# Altium project ACU (ra8m1_unshielded).PrjPcb (part 1 of 3)
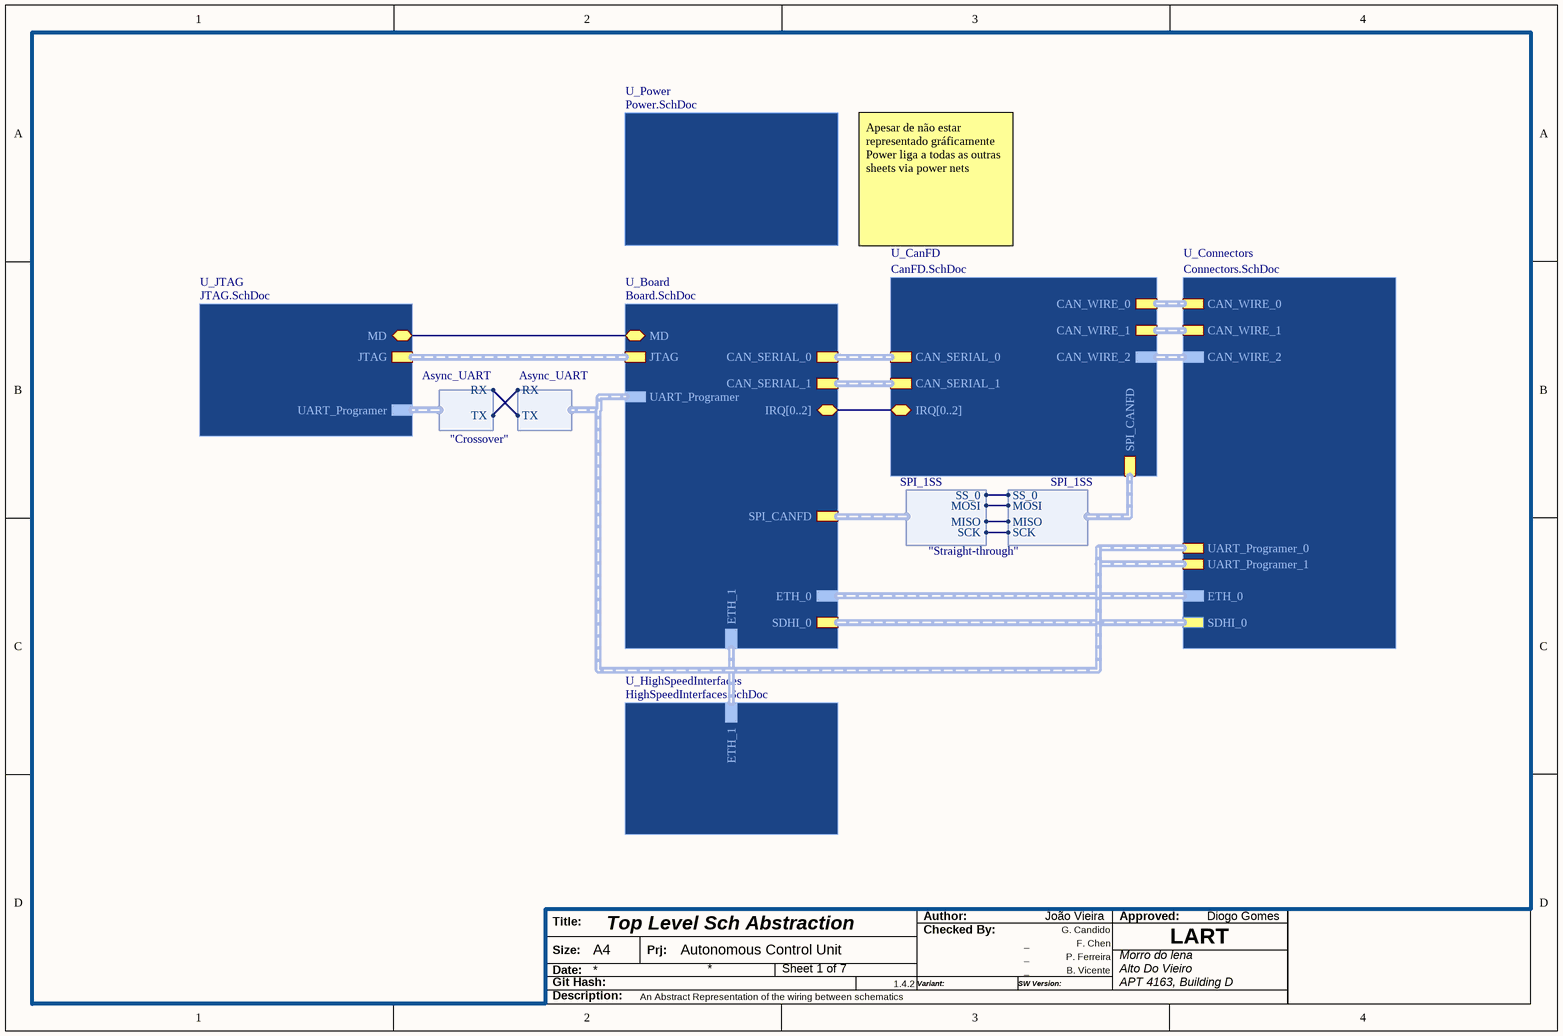
[diagram p0: TopLevelConnections.SchDoc]
12 sheets, 379 parts. Net scope: hierarchical (ports join the sheet entries above them; power ports are global).
Board file: BGA_ACUity.PcbDoc
Sheets:
  TopLevelConnections.SchDoc
    U_Connectors = Connectors.SchDoc
    U_CanFD = CanFD.SchDoc
    U_Board = Board.SchDoc
    U_JTAG = JTAG.SchDoc
    U_HighSpeedInterfaces = HighSpeedInterfaces.SchDoc
    U_Power = Power.SchDoc
  DrivePower.SchDoc
    U_Mosfets0 = Mosfets.SchDoc
    U_Mosfets1 = Mosfets.SchDoc
    U_Mosfets2 = Mosfets.SchDoc
    U_Mosfets3 = Mosfets.SchDoc
    U_Mosfets4 = Mosfets.SchDoc
    U_Mosfets5 = Mosfets.SchDoc
  Watchdog.SchDoc
  ADC-Filter.SchDoc
  TransceiversCanFD.SchDoc

## Sheet TopLevelConnections.SchDoc: Top Level Sch Abstraction
size A4; ApprovedBy: Diogo Gomes; CheckedBy: Bruno, Candido, Pedro; Author: João Vieira; CompanyName: LART; DrawnBy: João Vieira; Organization: LART; Address1: Morro do lena; Address2: Alto Do Vieiro; Address3: APT 4163, Building D; Revision: v1.4.2; SheetNumber: 1; SheetTotal: 7; ProjectTitle: Autonomous Control Unit; CheckedBy1: G. Candido; CheckedBy2: F. Chen; CheckedBy3: P. Ferreira; CheckedBy4: B. Vicente; CheckedBy5: _; CheckedBy6: _; CheckedBy7: _; CHK_APP_DATE: --/--/--; DSN_APP_DATE: --/--/--; ENG_APP_DATE: --/--/--; Summary: An Abstract Representation of the wiring between schematics; version_tag: 1.4.2; ImagePath: C:\Users\micron\Desktop

### Sub-sheets
U_Board = Board.SchDoc: JTAG (harness JTAG), CAN_SERIAL_0 (harness CAN_SERIAL), CAN_SERIAL_1 (harness CAN_SERIAL), ETH_0 (harness ETH_TX), ETH_1 (harness ETH_TX), UART_Programer (harness Async_UART), SDHI_0 (harness SDHI), SPI_CANFD (harness SPI_1SS), IRQ[0..2] (bidir), MD (bidir)
U_CanFD = CanFD.SchDoc: CAN_SERIAL_0 (harness CAN_SERIAL), CAN_SERIAL_1 (harness CAN_SERIAL), SPI_CANFD (harness SPI_1SS), IRQ[0..2] (bidir), CAN_WIRE_1 (harness CAN_WIRE), CAN_WIRE_0 (harness CAN_WIRE), CAN_WIRE_2 (harness CAN_WIRE)
U_Connectors = Connectors.SchDoc: ETH_0 (harness ETH_TX), SDHI_0 (harness SDHI), CAN_WIRE_0 (harness CAN_WIRE), CAN_WIRE_1 (harness CAN_WIRE), CAN_WIRE_2 (harness CAN_WIRE), UART_Programer_0 (harness Async_UART), UART_Programer_1 (harness Async_UART)
U_HighSpeedInterfaces = HighSpeedInterfaces.SchDoc: ETH_1 (harness ETH_TX)
U_JTAG = JTAG.SchDoc: JTAG (harness JTAG), UART_Programer (harness Async_UART), MD (bidir)
U_Power = Power.SchDoc: no entries

### Harnesses
Async_UART: RX, TX
SPI_1SS: MOSI, MISO, SCK, SS_0

### Nets
CANFD_MISO: sheet U_Board/SPI_CANFD.MISO, sheet U_CanFD/SPI_CANFD.MISO
CANFD_MOSI: sheet U_Board/SPI_CANFD.MOSI, sheet U_CanFD/SPI_CANFD.MOSI
CANFD_SCK: sheet U_Board/SPI_CANFD.SCK, sheet U_CanFD/SPI_CANFD.SCK
CANFD_SS: sheet U_Board/SPI_CANFD.SS_0, sheet U_CanFD/SPI_CANFD.SS_0
NetIC1#2_E9: sheet U_Board/MD, sheet U_JTAG/MD
NetJ23_RX_0: sheet U_Connectors/UART_Programer_0.RX, sheet U_JTAG/UART_Programer.TX
NetJ23_TX_0: sheet U_Connectors/UART_Programer_0.TX, sheet U_JTAG/UART_Programer.RX

### Buses and harness runs
bus sheet U_Board/IRQ[0..2] = sheet U_CanFD/IRQ[0..2]
harness sheet U_Board/CAN_SERIAL_0 = sheet U_CanFD/CAN_SERIAL_0
harness sheet U_Board/CAN_SERIAL_1 = sheet U_CanFD/CAN_SERIAL_1
harness sheet U_Board/ETH_0 = sheet U_Connectors/ETH_0
harness sheet U_Board/ETH_1 = sheet U_HighSpeedInterfaces/ETH_1
harness sheet U_Board/JTAG = sheet U_JTAG/JTAG
harness sheet U_Board/SDHI_0 = sheet U_Connectors/SDHI_0
harness sheet U_Board/UART_Programer = sheet U_Connectors/UART_Programer_0 = sheet U_Connectors/UART_Programer_1
harness sheet U_CanFD/CAN_WIRE_0 = sheet U_Connectors/CAN_WIRE_0
harness sheet U_CanFD/CAN_WIRE_1 = sheet U_Connectors/CAN_WIRE_1
harness sheet U_CanFD/CAN_WIRE_2 = sheet U_Connectors/CAN_WIRE_2

### Notes on the sheet
- Apesar de não estar representado gráficamente
  Power liga a todas as outras sheets via power nets
- "Crossover"
- "Straight-through"
- Title:
- Author:
- Checked By:
- Approved:
- Size:
- Date:
- Git Hash:
- A4
- Prj:
- Variant:
- SW Version:
- Description:

## Sheet Connectors.SchDoc: Connectors
size A4; ApprovedBy: Diogo Gomes; CheckedBy: Bruno, Candido, Pedro; Author: João Vieira; CompanyName: LART; DrawnBy: João Vieira; Organization: LART; Address1: Morro do Lena; Address2: Alto Do Vieiro; Address3: APT 4163, Building D; Revision: v1.4.2; SheetNumber: 3; SheetTotal: 7; ProjectTitle: Autonomous Control Unit; CheckedBy1: G. Candido; CheckedBy2: F. Chen; CheckedBy3: P. Ferreira; CheckedBy4: B. Vicente; CheckedBy5: _; CheckedBy6: _; CheckedBy7: _; version_tag: v1.4.2; Summary: Generic connections IO hardware; ImagePath: C:\Users\micron\Desktop
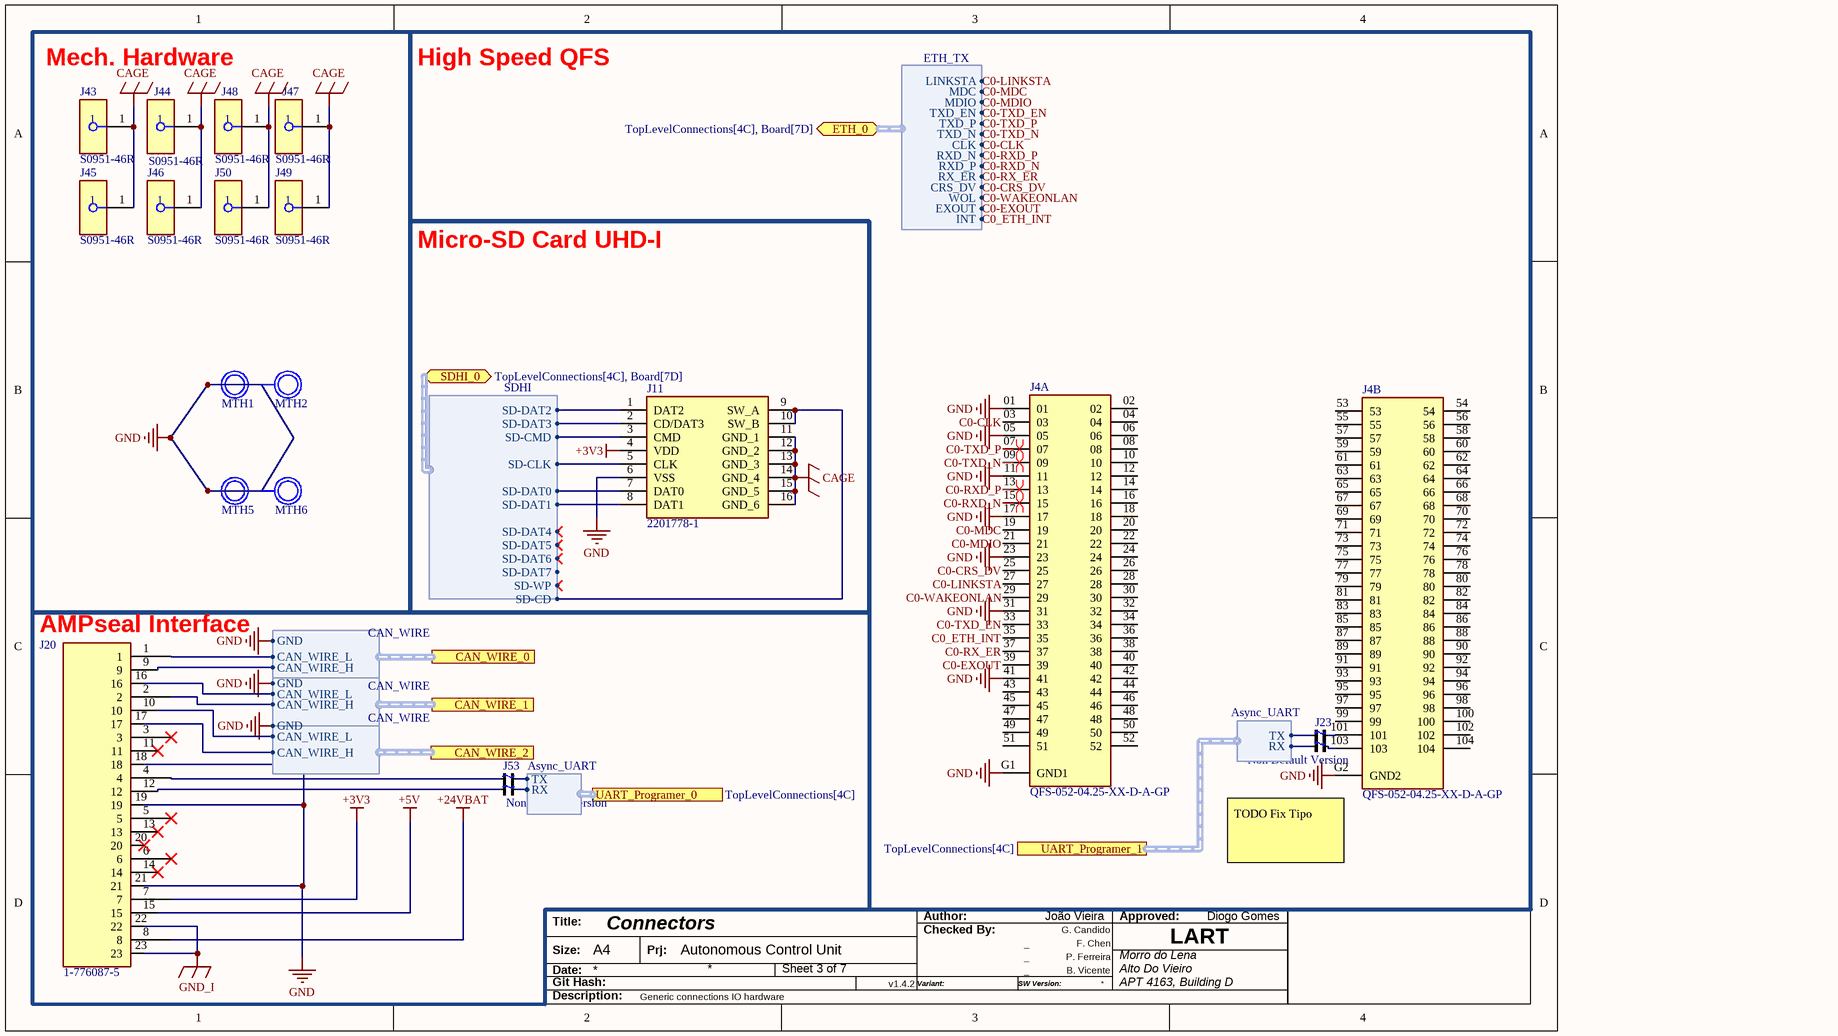
[diagram p1: Connectors.SchDoc]

### Parts
(Parts that share a designator on the sheet are numbered #1, #2 ... from top to bottom, then left to right.)
J4#1  QFS-052-04.25-XX-D-A-GP  [SAMTEC_QFS-052-04.25-XX-D-A-GP]  (parts A,B of 2)
J11#1  2201778-1  [22017781]
J20  1-776087-5  [TE_1-776087-5]
J23  Non Default Version  [PokaYoke Blank]  (no BOM)
J43#1  S0951-46R  [FP-S0951-46R-MFG]
J44#1  S0951-46R  [FP-S0951-46R-MFG]
J45#1  S0951-46R  [FP-S0951-46R-MFG]
J46#1  S0951-46R  [FP-S0951-46R-MFG]
J47#1  S0951-46R  [FP-S0951-46R-MFG]
J48#1  S0951-46R  [FP-S0951-46R-MFG]
J49#1  S0951-46R  [FP-S0951-46R-MFG]
J50  S0951-46R  [FP-S0951-46R-MFG]
J53  Non Default Version  [PokaYoke Blank]  (no BOM)
MTH1  Mounting_Hole_3.5mm  [Mounting_Hole_3.5mm]  (value not drawn)
MTH2  Mounting_Hole_3.5mm  [Mounting_Hole_3.5mm]  (value not drawn)
MTH5  Mounting_Hole_3.5mm  [Mounting_Hole_3.5mm]  (value not drawn)
MTH6  Mounting_Hole_3.5mm  [Mounting_Hole_3.5mm]  (value not drawn)

### Blocks framed on the sheet
Mech. Hardware: J43#1 J44#1 J45#1 J46#1 J47#1 J48#1 J49#1 J50 MTH1 MTH2 MTH5 MTH6
High Speed QFS: J4#1 J23
Micro-SD Card UHD-I: J11#1

### Ports
CAN_WIRE_0 (harness CAN_WIRE, see TopLevelConnections[4B], CanFD[3A]), CAN_WIRE_1 (harness CAN_WIRE, see TopLevelConnections[4B], CanFD[3B]), CAN_WIRE_2 (harness CAN_WIRE, see TopLevelConnections[4B], CanFD[3B]), ETH_0 (bidir, harness ETH_TX, see TopLevelConnections[4C], Board[7D]), SDHI_0 (bidir, harness SDHI, see TopLevelConnections[4C], Board[7D]), UART_Programer_0 (harness Async_UART, see TopLevelConnections[4C]), UART_Programer_1 (harness Async_UART, see TopLevelConnections[4C])

### Harnesses
ETH_TX: MDC, MDIO, TXD_EN, TXD_P, TXD_N, CLK, RXD_N, RXD_P, RX_ER, LINKSTA, CRS_DV, WOL, EXOUT, INT
SDHI: SD-CD, SD-CLK, SD-CMD, SD-DAT0, SD-DAT1, SD-DAT2, SD-DAT3, SD-DAT5, SD-DAT6, SD-WP, SD-DAT4, SD-DAT7
CAN_WIRE: GND, CAN_WIRE_H, CAN_WIRE_L
Async_UART: RX, TX

### Nets
+3V3: J11#1.4(VDD) J20.7
+5V: J20.15
+24VBAT: J20.8
CAGE: J11#1.11(GND_1) J11#1.12(GND_2) J11#1.13(GND_3) J11#1.14(GND_4) J11#1.15(GND_5) J11#1.16(GND_6) J43#1.1 J44#1.1 J45#1.1 J46#1.1 J47#1.1 J48#1.1 J49#1.1 J50.1
GND: J4#1.01 J4#1.05 J4#1.11 J4#1.17 J4#1.23 J4#1.31 J4#1.41 J4#1.G1(GND1) J4#1.G2(GND2) J11#1.6(VSS) J20.18 J20.19 J20.21 MTH1.1 MTH2.1 MTH5.1 MTH6.1 ; port CAN_WIRE_1.GND, port CAN_WIRE_0.GND, port CAN_WIRE_2.GND
GND_I: J20.22 J20.23
C0-CLK: J4#1.03 ; port ETH_0.CLK
C0-CRS_DV: J4#1.25 ; port ETH_0.CRS_DV
C0-EXOUT: J4#1.39 ; port ETH_0.EXOUT
C0-LINKSTA: J4#1.27 ; port ETH_0.LINKSTA
C0-MDC: J4#1.19 ; port ETH_0.MDC
C0-MDIO: J4#1.21 ; port ETH_0.MDIO
C0-RX_ER: J4#1.37 ; port ETH_0.RX_ER
C0-RXD_N: J4#1.15 ; port ETH_0.RXD_P
C0-RXD_P: J4#1.13 ; port ETH_0.RXD_N
C0-TXD_EN: J4#1.33 ; port ETH_0.TXD_EN
C0-TXD_N: J4#1.09 ; port ETH_0.TXD_N
C0-TXD_P: J4#1.07 ; port ETH_0.TXD_P
C0-WAKEONLAN: J4#1.29 ; port ETH_0.WOL
C0_ETH_INT: J4#1.35 ; port ETH_0.INT
SD_CD: J11#1.9(SW_A) J11#1.10(SW_B) ; port SDHI_0.SD-CD
SD_CLK: J11#1.5(CLK) ; port SDHI_0.SD-CLK
SD_CMD: J11#1.3(CMD) ; port SDHI_0.SD-CMD
SD_DATA0: J11#1.7(DAT0) ; port SDHI_0.SD-DAT0
SD_DATA1: J11#1.8(DAT1) ; port SDHI_0.SD-DAT1
SD_DATA2: J11#1.1(DAT2) ; port SDHI_0.SD-DAT2
SD_DATA3: J11#1.2(CD/DAT3) ; port SDHI_0.SD-DAT3
NetIC1#1_6: J20.1 ; port CAN_WIRE_0.CAN_WIRE_L
NetIC1#1_7: J20.9 ; port CAN_WIRE_0.CAN_WIRE_H
NetIC2#1_6: J20.16 ; port CAN_WIRE_1.CAN_WIRE_L
NetIC2#1_7: J20.2 ; port CAN_WIRE_1.CAN_WIRE_H
NetIC3_6: J20.10 ; port CAN_WIRE_2.CAN_WIRE_L
NetIC3_7: J20.17 ; port CAN_WIRE_2.CAN_WIRE_H
NetJ4#1_101: J4#1.101 J23.TX_1
NetJ4#1_103: J4#1.103 J23.RX_1
NetJ20_4: J20.4 J53.TX_0
NetJ20_12: J20.12 J53.RX_0
NetJ23_RX_0: J23.RX_0 J53.RX_1 ; port UART_Programer_0.RX
NetJ23_TX_0: J23.TX_0 J53.TX_1 ; port UART_Programer_0.TX

Not connected (* = marked no-connect by the designer): J4#1 02 04 06 08 10 12 14 16 18 20 22 24 26 28 30 32 34 36 38 40 42 43 44 45 46 47 48 49 50 51 52 53 54 55 56 57 58 59 60 61 62 63 64 65 66 67 68 69 70 71 72 73 74 75 76 77 78 79 80 81 82 83 84 85 86 87 88 89 90 91 92 93 94 95 96 97 98 99 100 102 104; J20 3* 5* 6* 11* 13* 14* 20*

### Layout directives
differential pair: C0-RXD_N, C0-RXD_P, C0-TXD_N, C0-TXD_P

### Notes on the sheet
- (near J20) AMPseal Interface
- (near J4#1) TODO Fix Tipo
- Title:
- Author:
- Checked By:
- Approved:
- Size:
- Date:
- Git Hash:
- A4
- Prj:
- Variant:
- SW Version:
- Description:

### Library data of the parts
J4#1 = QFS-052-04.25-XX-D-A-GP: CONN RCPT 104POS SMD GOLD; Availability: Unavailable; Package: None; MP: QFS-052-04.25-XX-D-A-GP; Value: *; Price: None
J11#1 = 2201778-1: Connector; Manufacturer_Name: TE Connectivity; Datasheet Link: https://www.te.com/commerce/DocumentDelivery/DDEController?Action=showdoc&DocId=Customer+Drawing%7F2201778%7FB%7Fpdf%7FJapanese%7FJPN_CD_2201778_B.pdf%7F2201778-1; Height: 1.95mm; Manufacturer_Part_Number: 2201778-1; Mouser Part Number: 571-2201778-1; Mouser Price/Stock: https://www.mouser.co.uk/ProductDetail/TE-Connectivity/2201778-1?qs=%2F6W%2F9%2FHWvcBMWWw9w8oBng%3D%3D; Arrow Part Number: 2201778-1; Arrow Price/Stock: https://www.arrow.com/en/products/2201778-1/te-connectivity?region=nac
J20 = 1-776087-5: CONN HDR 23POS R/A W/GASKET AU; MF: {'manufacturer': 'TE Connectivity'}; Package: None; Value: *; Availability: Unavailable; MP: 1-776087-5; Price: None
J23 J53 = Poka-Yoke 2x2
J43#1 J44#1 J45#1 J46#1 J47#1 J48#1 J49#1 J50 = CMP-002-00075-1: Assembly Item

## Sheet CanFD.SchDoc: CanFD Components
size A4; ApprovedBy: Diogo Gomes; CheckedBy: Bruno, Candido, Pedro; Author: João Vieira; CompanyName: LART; DrawnBy: João Vieira; Organization: LART; Address1: Morro do lena; Address2: Alto Do Vieiro; Address3: APT 4163, Building D; Revision: v1.4.2; SheetNumber: 5; SheetTotal: 7; ProjectTitle: Autonomous Control Unit; CheckedBy1: G. Candido; CheckedBy2: F. Chen; CheckedBy3: P. Ferreira; CheckedBy4: B. Vicente; CheckedBy5: _; CheckedBy6: _; CheckedBy7: _; CHK_APP_DATE: --/--/--; DSN_APP_DATE: --/--/--; ENG_APP_DATE: --/--/--; Summary: Various CAN FD components; version_tag: 1.4.2; ImagePath: C:\Users\micron\Desktop
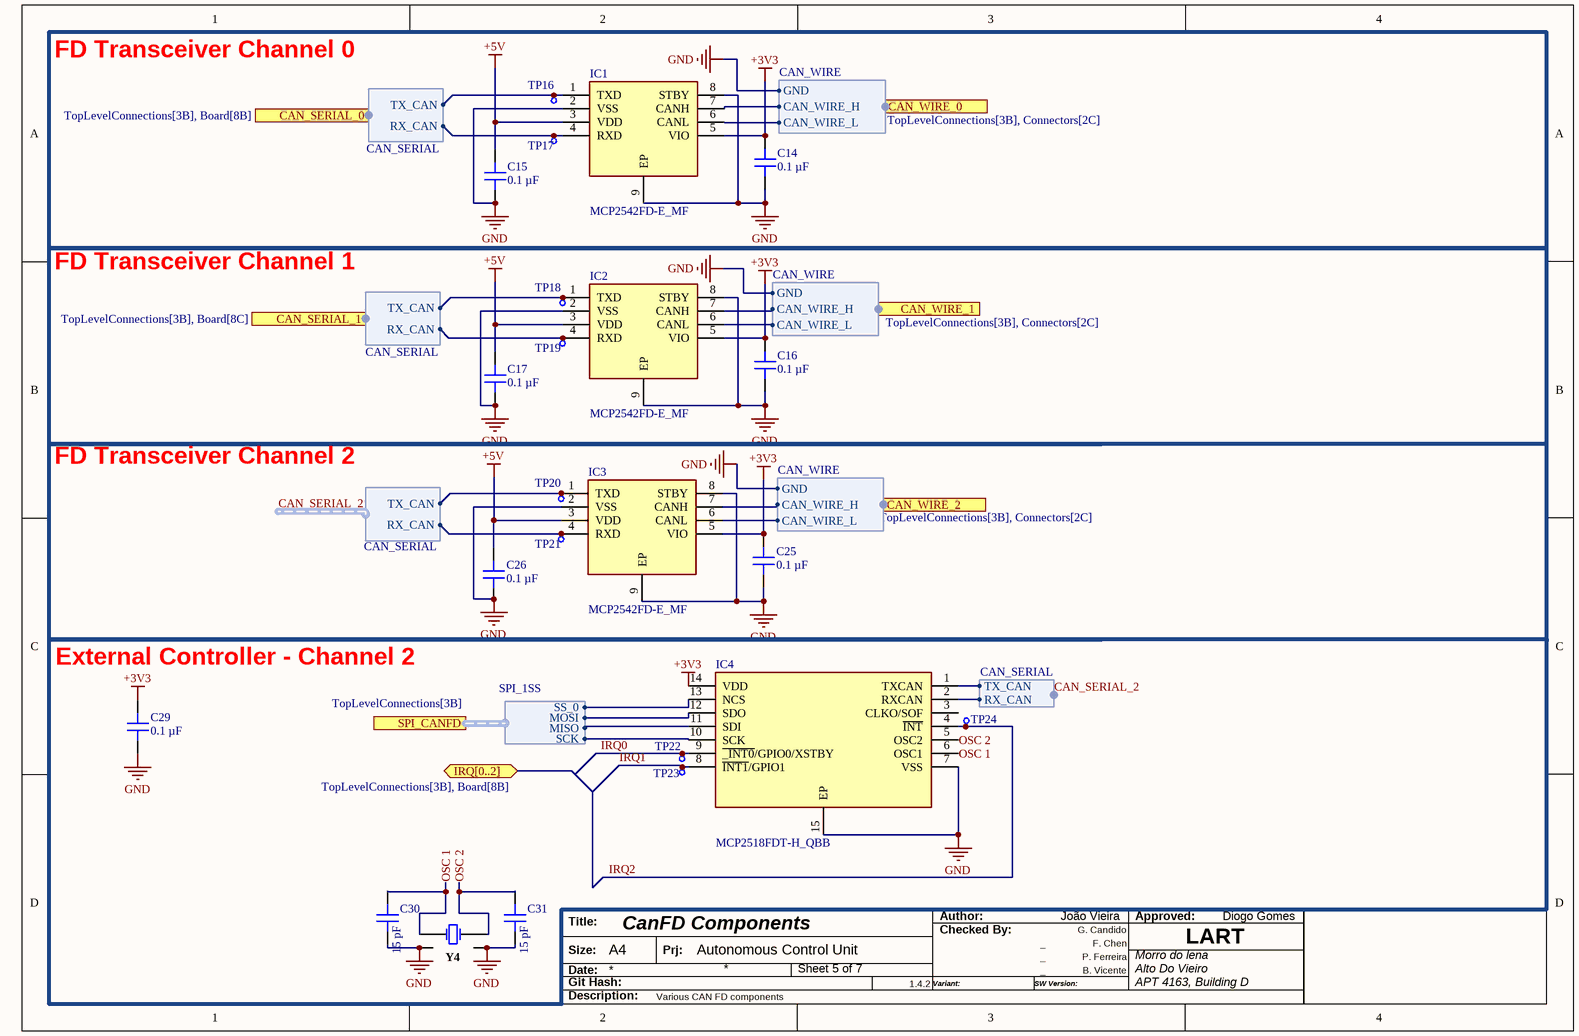
[diagram p2: CanFD.SchDoc]

### Parts
(Parts that share a designator on the sheet are numbered #1, #2 ... from top to bottom, then left to right.)
C14  value 0.1 µF  [CAP 0805_2012]  (hidden comment: 0.1uF)
C15#1  value 0.1 µF  [CAP 0805_2012]  (hidden comment: 0.1uF)
C16#1  value 0.1 µF  [CAP 0805_2012]  (hidden comment: 0.1uF)
C17#1  value 0.1 µF  [CAP 0805_2012]  (hidden comment: 0.1uF)
C25#1  value 0.1 µF  [CAP 0805_2012]  (hidden comment: 0.1uF)
C26#1  value 0.1 µF  [CAP 0805_2012]  (hidden comment: 0.1uF)
C29#1  0.1 µF  [CAP 0805_2012]
C30  15 pF  [CAP 0805_2012]
C31#1  15 pF  [CAP 0805_2012]
IC1#1  MCP2542FD-E_MF  [SON65P300X300X100-9N-D]
IC2#1  MCP2542FD-E_MF  [SON65P300X300X100-9N-D]
IC3  MCP2542FD-E_MF  [SON65P300X300X100-9N-D]
IC4  MCP2518FDT-H_QBB  [SON65P300X450X90-15N-D]
TP16#1  TestPad  [Test Pad Small]  (value not drawn)
TP17#1  TestPad  [Test Pad Small]  (value not drawn)
TP18  TestPad  [Test Pad Small]  (value not drawn)
TP19  TestPad  [Test Pad Small]  (value not drawn)
TP20#1  TestPad  [Test Pad Small]  (value not drawn)
TP21  TestPad  [Test Pad Small]  (value not drawn)
TP22  TestPad  [Test Pad Small]  (value not drawn)
TP23#1  TestPad  [Test Pad Small]  (value not drawn)
TP24#1  TestPad  [Test Pad Small]  (value not drawn)
Y4#1  ABM8-20.000MHZ-10-1-U-T  [FP-ABM8-MFG]  (value not drawn)

### Blocks framed on the sheet
FD Transceiver Channel 0: C14 C15#1 IC1#1 TP16#1 TP17#1
External Controller - Channel 2: C29#1 C30 C31#1 IC4 TP22 TP23#1 TP24#1 Y4#1

### Ports
CAN_SERIAL_0 (harness CAN_SERIAL, see TopLevelConnections[3B], Board[8B]), CAN_SERIAL_1 (harness CAN_SERIAL, see TopLevelConnections[3B], Board[8C]), CAN_WIRE_0 (harness CAN_WIRE, see TopLevelConnections[3B], Connectors[2C]), CAN_WIRE_1 (harness CAN_WIRE, see TopLevelConnections[3B], Connectors[2C]), CAN_WIRE_2 (harness CAN_WIRE, see TopLevelConnections[3B], Connectors[2C]), IRQ[0..2] (bidir, see TopLevelConnections[3B], Board[8B]), SPI_CANFD (harness SPI_1SS, see TopLevelConnections[3B])

### Harnesses
CAN_SERIAL: RX_CAN, TX_CAN
CAN_WIRE: GND, CAN_WIRE_H, CAN_WIRE_L
SPI_1SS: MOSI, MISO, SS_0, SCK

### Nets
+3V3: C14.2 C16#1.2 C25#1.2 C29#1.2 IC1#1.5(VIO) IC2#1.5(VIO) IC3.5(VIO) IC4.14(VDD)
+5V: C15#1.2 C17#1.2 C26#1.2 IC1#1.3(VDD) IC2#1.3(VDD) IC3.3(VDD)
GND: C14.1 C15#1.1 C16#1.1 C17#1.1 C25#1.1 C26#1.1 C29#1.1 C30.1 C31#1.1 IC1#1.2(VSS) IC1#1.8(STBY) IC1#1.9(EP) IC2#1.2(VSS) IC2#1.8(STBY) IC2#1.9(EP) IC3.2(VSS) IC3.8(STBY) IC3.9(EP) IC4.7(VSS) IC4.15(EP) Y4#1.3 Y4#1.4 ; port CAN_WIRE_0.GND, port CAN_WIRE_1.GND, port CAN_WIRE_2.GND
CAN_RX_0: IC1#1.4(RXD) TP17#1.P2 ; port CAN_SERIAL_0.RX_CAN
CAN_RX_1: IC2#1.4(RXD) TP19.P2 ; port CAN_SERIAL_1.RX_CAN
CAN_SERIAL_2.RX_CAN: IC3.4(RXD) IC4.2(RXCAN) TP21.P2 ; harness CAN_SERIAL.RX_CAN
CAN_SERIAL_2.TX_CAN: IC3.1(TXD) IC4.1(TXCAN) TP20#1.P2 ; harness CAN_SERIAL.TX_CAN
CAN_TX_0: IC1#1.1(TXD) TP16#1.P2 ; port CAN_SERIAL_0.TX_CAN
CAN_TX_1: IC2#1.1(TXD) TP18.P2 ; port CAN_SERIAL_1.TX_CAN
CANFD_MISO: IC4.11(SDI) ; port SPI_CANFD.MISO
CANFD_MOSI: IC4.12(SDO) ; port SPI_CANFD.MOSI
CANFD_SCK: IC4.10(SCK) ; port SPI_CANFD.SCK
CANFD_SS: IC4.13(NCS) ; port SPI_CANFD.SS_0
IRQ0: IC4.9(~{_INT0}/GPIO0/XSTBY) TP22.P2  [project net IRQ0_5]
IRQ1: IC4.8(~{INT1}/GPIO1) TP23#1.P2  [project net IRQ1_5]
IRQ2: IC4.4(~{INT}) TP24#1.P2  [project net IRQ2_5]
OSC 1: C30.2 IC4.6(OSC1) Y4#1.1  [project net OSC 1_5]
OSC 2: C31#1.2 IC4.5(OSC2) Y4#1.2  [project net OSC 2_5]
NetIC1#1_6: IC1#1.6(CANL) ; port CAN_WIRE_0.CAN_WIRE_L
NetIC1#1_7: IC1#1.7(CANH) ; port CAN_WIRE_0.CAN_WIRE_H
NetIC2#1_6: IC2#1.6(CANL) ; port CAN_WIRE_1.CAN_WIRE_L
NetIC2#1_7: IC2#1.7(CANH) ; port CAN_WIRE_1.CAN_WIRE_H
NetIC3_6: IC3.6(CANL) ; port CAN_WIRE_2.CAN_WIRE_L
NetIC3_7: IC3.7(CANH) ; port CAN_WIRE_2.CAN_WIRE_H

Not connected (* = marked no-connect by the designer): IC4 3(CLKO/SOF)

### Notes on the sheet
- FD Transceiver Channel 1
- FD Transceiver Channel 2
- Title:
- Author:
- Checked By:
- Approved:
- Size:
- Date:
- Git Hash:
- A4
- Prj:
- Variant:
- SW Version:
- Description:

### Library data of the parts
C14 C15#1 C16#1 C17#1 C25#1 C26#1 = CC0805MRX7R9BB104: CAP CER 0.1UF 50V X7R 0805; manufacturer: Yageo; Tolerance: ±20%; Part Number: CC0805MRX7R9BB104; Applications: General Purpose; Capacitance: 0.1 µF; componentlink1description: Datasheet; componentlink1url: https://www.yageo.com/upload/media/product/productsearch/datasheet/mlcc/UPY-GPHC_X7R_6.3V-to-50V_18.pdf; componentlink2description: DigiKey Link; componentlink2url: https://www.digikey.com/en/products/detail/yageo/CC0805MRX7R9BB104/5884281; Device Package: 0805 (2012 Metric); lastupdated: 09/02/2024 20:16:09; Lifecycle Status: Active; Minimum Order: 1; Mounting Type: Surface Mount, MLCC; Operating Temperature: -55°C ~ 125°C; Package / Case: 0805 (2012 Metric); packaging: TapeAndReel; partid: 2475; Part Status: Active; price: 0.01; series: CC; Size / Dimension: 0.079" L x 0.049" W (2.00mm x 1.25mm); Supplier 1: DigiKey; Supplier Part Number 1: 311-4351-1-ND; Temperature Coefficient: X7R; Thickness (Max): 0.037" (0.95mm); Voltage - Rated: 50V
C29#1 = VJ0805Y104MXAMR: CAP CER 0.1UF 50V X7R 0805; manufacturer: Vishay Vitramon; Tolerance: ±20%; Part Number: VJ0805Y104MXAMR; Value: 0.1 µF; Applications: General Purpose; Capacitance: 0.1 µF; componentlink1description: Datasheet; componentlink1url: http://www.vishay.com/docs/45199/vjcommercialseries.pdf; componentlink2description: DigiKey Link; componentlink2url: https://www.digikey.com/en/products/detail/vishay-vitramon/VJ0805Y104MXAMR/8311084; Device Package: 0805 (2012 Metric); lastupdated: 04/02/2024 20:15:56; Lifecycle Status: Active; Minimum Order: 1; Mounting Type: Surface Mount, MLCC; Operating Temperature: -55°C ~ 150°C; Package / Case: 0805 (2012 Metric); packaging: TapeAndReel; partid: 14439; Part Status: Active; price: 0.09; series: VJ; Size / Dimension: 0.079" L x 0.049" W (2.00mm x 1.25mm); Supplier 1: DigiKey; Supplier Part Number 1: 720-1755-1-ND; Temperature Coefficient: X7R; Thickness (Max): 0.057" (1.45mm); Voltage - Rated: 50V
C30 C31#1 = VJ0805D150JXPQJHT: CAP CER 15PF 250V C0G/NP0 0805; manufacturer: Vishay Vitramon; Temperature Coefficient: C0G, NP0; Tolerance: ±5%; Part Number: VJ0805D150JXPQJHT; Value: 15 pF; Applications: RF, Microwave, High Frequency; Capacitance: 15 pF; componentlink1description: Datasheet; componentlink1url: https://www.vishay.com/docs/45239/vjhifreqht.pdf; componentlink2description: DigiKey Link; componentlink2url: https://www.digikey.com/en/products/detail/vishay-vitramon/VJ0805D150JXPQJHT/14292748; Device Package: 0805 (2012 Metric); Features: High Temperature; lastupdated: 04/02/2024 20:15:19; Lifecycle Status: Active; Minimum Order: 1; Mounting Type: Surface Mount, MLCC; Operating Temperature: -55°C ~ 200°C; Package / Case: 0805 (2012 Metric); packaging: TapeAndReel; partid: 31685; Part Status: Active; price: 0.11; series: VJ HIFREQ HT; Size / Dimension: 0.079" L x 0.049" W (2.00mm x 1.25mm); Supplier 1: DigiKey; Supplier Part Number 1: 720-VJ0805D150JXPQJHTCT-ND; Thickness (Max): 0.057" (1.45mm); Voltage - Rated: 250V
IC1#1 IC2#1 IC3 = MCP2542FD-E_MF: Integrated Circuit; Manufacturer_Name: Microchip; Manufacturer_Part_Number: MCP2542FD-E/MF; Datasheet Link: http://ww1.microchip.com/downloads/en/devicedoc/20005514a.pdf; Height: 1mm; Mouser Part Number: 579-MCP2542FD-E/MF; Mouser Price/Stock: https://www.mouser.co.uk/ProductDetail/Microchip-Technology-Atmel/MCP2542FD-E-MF?qs=l7cgNqFNU1jog4BwTzULBw%3D%3D; Arrow Part Number: MCP2542FD-E/MF; Arrow Price/Stock: https://www.arrow.com/en/products/mcp2542fd-emf/microchip-technology?region=nac
IC4 = MCP2518FDT-H_QBB: Integrated Circuit; Manufacturer_Name: Microchip; Manufacturer_Part_Number: MCP2518FDT-H/QBB; Datasheet Link: https://www.mouser.in/datasheet/2/268/MCP2518FD-Data-Sheet-20006027A-1596921.pdf; Height: 0.9mm; Mouser Part Number: 579-MCP2518FDT-H/QBB; Mouser Price/Stock: https://www.mouser.co.uk/ProductDetail/Microchip-Technology/MCP2518FDT-H-QBB?qs=T3oQrply3y8bDZ20CsIcGQ%3D%3D; Arrow Part Number: MCP2518FDT-H/QBB; Arrow Price/Stock: https://www.arrow.com/en/products/mcp2518fdt-hqbb/microchip-technology?region=nac
Y4#1 = CMP-003-00030-2: Crystal 20MHz ±10ppm (Tol) ±10ppm (Stability) 10pF FUND 50Ohm 4-Pin Ultra Mini-CSMD T/R

## Sheet Board.SchDoc: Main MCU
size A3; ApprovedBy: Diogo Gomes; CheckedBy: Bruno, Candido, Pedro; Author: João Vieira; CompanyName: LART; DrawnBy: João Vieira; Organization: LART; Address1: Morro do lena; Address2: Alto Do Vieiro; Address3: APT 4163, Building D; Revision: v1.4.2; SheetNumber: 4; SheetTotal: 12; ProjectTitle: Autonomous Control Unit; CheckedBy1: G. Candido; CheckedBy2: F. Chen; CheckedBy3: P. Ferreira; CheckedBy4: B. Vicente; CheckedBy5: _; CheckedBy6: _; CheckedBy7: _; CHK_APP_DATE: --/--/--; DSN_APP_DATE: --/--/--; ENG_APP_DATE: --/--/--; Summary: The Main Microcontroller that powers the entire ACU; version_tag: 1.4.2; ImagePath: C:\Users\micron\Desktop
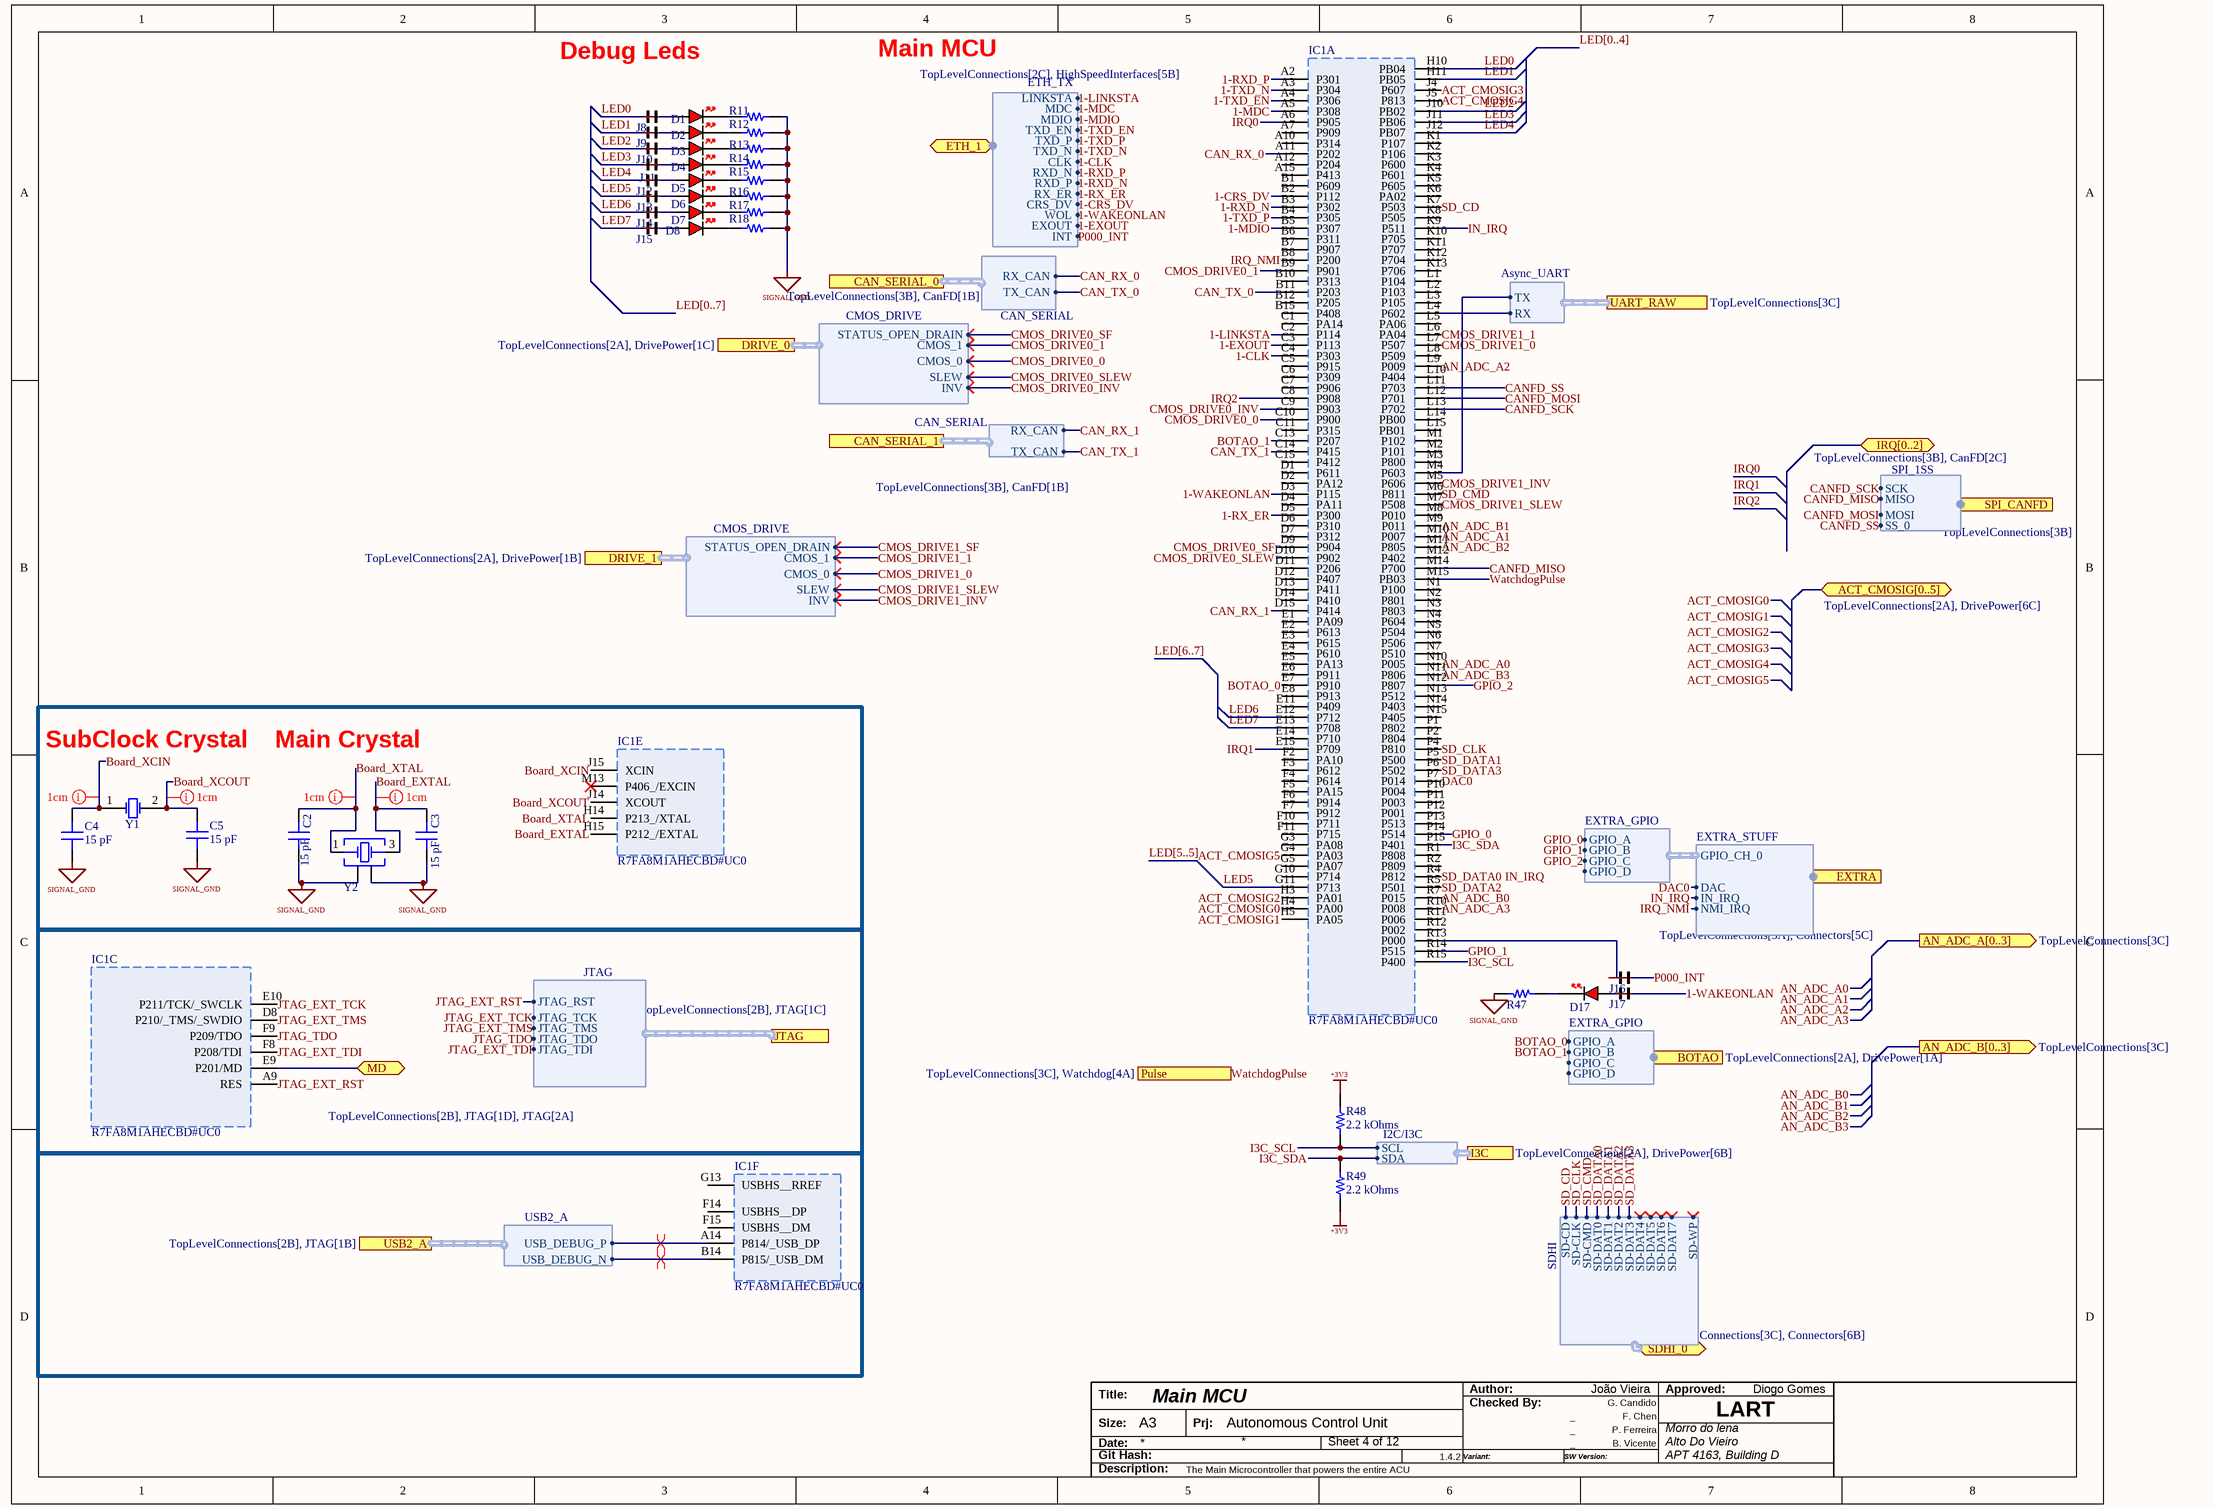
[diagram p3: Board.SchDoc]

### Parts
(Parts that share a designator on the sheet are numbered #1, #2 ... from top to bottom, then left to right.)
C2  value 15 pF  [CAP 0805_2012]  (hidden comment: 15pF)
C3  value 15 pF  [CAP 0805_2012]  (hidden comment: 15pF)
C4  value 15 pF  [CAP 0805_2012]  (hidden comment: 15pF)
C5  value 15 pF  [CAP 0805_2012]  (hidden comment: 15pF)
D1  RED  [LED_0603_RED]  (value not drawn)
D2  RED  [LED_0603_RED]  (value not drawn)
D3  RED  [LED_0603_RED]  (value not drawn)
D4  RED  [LED_0603_RED]  (value not drawn)
D5  RED  [LED_0603_RED]  (value not drawn)
D6  RED  [LED_0603_RED]  (value not drawn)
D7  RED  [LED_0603_RED]  (value not drawn)
D8  RED  [LED_0603_RED]  (value not drawn)
D17  RED  [LED_0603_RED]  (value not drawn)
IC1#2  R7FA8M1AHECBD#UC0  [RA8M1_BGA]  (parts A,C,E,F of 6)
J8  A solder Bridge  [Solder Bridge 805]  (value not drawn)
J9  A solder Bridge  [Solder Bridge 805]  (value not drawn)
J10  A solder Bridge  [Solder Bridge 805]  (value not drawn)
J11#2  A solder Bridge  [Solder Bridge 805]  (value not drawn)
J12  A solder Bridge  [Solder Bridge 805]  (value not drawn)
J13  A solder Bridge  [Solder Bridge 805]  (value not drawn)
J14  A solder Bridge  [Solder Bridge 805]  (value not drawn)
J15  A solder Bridge  [Solder Bridge 805]  (value not drawn)
J16  A solder Bridge  [Solder Bridge 805]  (value not drawn)
J17  A solder Bridge  [Solder Bridge 805]  (value not drawn)
R11  LEDS  [RES 0805_2012]  (value not drawn)
R12  LEDS  [RES 0805_2012]  (value not drawn)
R13  LEDS  [RES 0805_2012]  (value not drawn)
R14  LEDS  [RES 0805_2012]  (value not drawn)
R15  LEDS  [RES 0805_2012]  (value not drawn)
R16  LEDS  [RES 0805_2012]  (value not drawn)
R17  LEDS  [RES 0805_2012]  (value not drawn)
R18  LEDS  [RES 0805_2012]  (value not drawn)
R47  LEDS  [RES 0805_2012]  (value not drawn)
R48  2.2 kOhms  [RES 0402_1005]
R49  2.2 kOhms  [RES 0402_1005]
Y1  32.768kHz  [WE-XTAL_IQXC-25]  (value not drawn)
Y2  20MHz  [WE-XTAL_CFPX-180]  (value not drawn)

### Ports
ACT_CMOSIG[0..5] (bidir, see TopLevelConnections[2A], DrivePower[6C]), AN_ADC_A[0..3] (out, see TopLevelConnections[3C]), AN_ADC_B[0..3] (out, see TopLevelConnections[3C]), BOTAO (harness EXTRA_GPIO, see TopLevelConnections[2A], DrivePower[1A]), CAN_SERIAL_0 (harness CAN_SERIAL, see TopLevelConnections[3B], CanFD[1B]), CAN_SERIAL_1 (harness CAN_SERIAL, see TopLevelConnections[3B], CanFD[1B]), DRIVE_0 (harness CMOS_DRIVE, see TopLevelConnections[2A], DrivePower[1C]), DRIVE_1 (harness CMOS_DRIVE, see TopLevelConnections[2A], DrivePower[1B]), ETH_1 (bidir, harness ETH_TX, see TopLevelConnections[2C], HighSpeedInterfaces[5B]), EXTRA (harness EXTRA_STUFF, see TopLevelConnections[3A], Connectors[5C]), I3C (harness I2C/I3C, see TopLevelConnections[2A], DrivePower[6B]), IRQ[0..2] (bidir, see TopLevelConnections[3B], CanFD[2C]), JTAG (harness JTAG, see TopLevelConnections[2B], JTAG[1C]), MD (bidir, see TopLevelConnections[2B], JTAG[1D], JTAG[2A]), Pulse (in, see TopLevelConnections[3C], Watchdog[4A]), SDHI_0 (bidir, harness SDHI, see TopLevelConnections[3C], Connectors[6B]), SPI_CANFD (harness SPI_1SS, see TopLevelConnections[3B]), UART_RAW (harness Async_UART, see TopLevelConnections[3C]), USB2_A (harness USB2_A, see TopLevelConnections[2B], JTAG[1B])

### Harnesses
JTAG: JTAG_RST, JTAG_TCK, JTAG_TMS, JTAG_TDO, JTAG_TDI
ETH_TX: MDC, MDIO, TXD_EN, TXD_P, TXD_N, CLK, RXD_N, RXD_P, RX_ER, LINKSTA, CRS_DV, WOL, EXOUT, INT
CAN_SERIAL: RX_CAN, TX_CAN
Async_UART: RX, TX
SDHI: SD-CD, SD-CLK, SD-CMD, SD-DAT0, SD-DAT1, SD-DAT2, SD-DAT3, SD-DAT4, SD-DAT5, SD-DAT6, SD-DAT7, SD-WP
SPI_1SS: MOSI, MISO, SCK, SS_0
USB2_A: USB_DEBUG_N, USB_DEBUG_P
CMOS_DRIVE: CMOS_0, CMOS_1, INV, SLEW, STATUS_OPEN_DRAIN
EXTRA_STUFF: GPIO_CH_0, DAC, IN_IRQ, NMI_IRQ
EXTRA_GPIO: GPIO_A, GPIO_B, GPIO_C, GPIO_D
I2C/I3C: SCL, SDA

### Nets
+3V3: R48.2 R49.1
SIGNAL_GND: C2.1 C3.1 C4.1 C5.1 R11.2 R12.2 R13.2 R14.2 R15.2 R16.2 R17.2 R18.2 R47.2 Y2.2(GND&Lid) Y2.4(GND&Lid)
1-CLK: IC1#2.C4(P303) ; port ETH_1.CLK
1-CRS_DV: IC1#2.B2(P112) ; port ETH_1.CRS_DV
1-EXOUT: IC1#2.C3(P113) ; port ETH_1.EXOUT
1-LINKSTA: IC1#2.C2(P114) ; port ETH_1.LINKSTA
1-MDC: IC1#2.A5(P308) ; port ETH_1.MDC
1-MDIO: IC1#2.B5(P307) ; port ETH_1.MDIO
1-RX_ER: IC1#2.D5(P300) ; port ETH_1.RX_ER
1-RXD_N: IC1#2.B3(P302) ; port ETH_1.RXD_P
1-RXD_P: IC1#2.A2(P301) ; port ETH_1.RXD_N
1-TXD_EN: IC1#2.A4(P306) ; port ETH_1.TXD_EN
1-TXD_N: IC1#2.A3(P304) ; port ETH_1.TXD_N
1-TXD_P: IC1#2.B4(P305) ; port ETH_1.TXD_P
1-WAKEONLAN: IC1#2.D3(P115) J17.P1 ; port ETH_1.WOL
ACT_CMOSIG0: IC1#2.H4(PA00)  [project net ACT_CMOSIG0_4]
ACT_CMOSIG1: IC1#2.H5(PA05)  [project net ACT_CMOSIG1_4]
ACT_CMOSIG2: IC1#2.H3(PA01)  [project net ACT_CMOSIG2_4]
ACT_CMOSIG3: IC1#2.J4(P607)  [project net ACT_CMOSIG3_4]
ACT_CMOSIG4: IC1#2.J5(P813)  [project net ACT_CMOSIG4_4]
ACT_CMOSIG5: IC1#2.G4(PA03)  [project net ACT_CMOSIG5_4]
AN_ADC_A0: IC1#2.N10(P005)  [project net AN_ADC_A0_4]
AN_ADC_A1: IC1#2.M10(P007)  [project net AN_ADC_A1_4]
AN_ADC_A2: IC1#2.L9(P009)  [project net AN_ADC_A2_4]
AN_ADC_A3: IC1#2.R10(P008)  [project net AN_ADC_A3_4]
AN_ADC_B0: IC1#2.R7(P015)  [project net AN_ADC_B0_4]
AN_ADC_B1: IC1#2.M9(P011)  [project net AN_ADC_B1_4]
AN_ADC_B2: IC1#2.M11(P805)  [project net AN_ADC_B2_4]
AN_ADC_B3: IC1#2.N11(P806)  [project net AN_ADC_B3_4]
Board_EXTAL: C3.2 IC1#2.H15(P212_/EXTAL) Y2.3(Crystal)  [project net Board_EXTAL_4]
Board_XCIN: C4.2 IC1#2.J15(XCIN) Y1.1(OSC1)  [project net Board_XCIN_4]
Board_XCOUT: C5.2 IC1#2.J14(XCOUT) Y1.2(OSC2)  [project net Board_XCOUT_4]
Board_XTAL: C2.2 IC1#2.H14(P213_/XTAL) Y2.1(Crystal)  [project net Board_XTAL_4]
BOTAO_0: IC1#2.E7(P910) ; port BOTAO.GPIO_A
BOTAO_1: IC1#2.C13(P207) ; port BOTAO.GPIO_B
CAN_RX_0: IC1#2.A11(P202) ; port CAN_SERIAL_0.RX_CAN
CAN_RX_1: IC1#2.D15(P414) ; port CAN_SERIAL_1.RX_CAN
CAN_TX_0: IC1#2.B11(P203) ; port CAN_SERIAL_0.TX_CAN
CAN_TX_1: IC1#2.C14(P415) ; port CAN_SERIAL_1.TX_CAN
CANFD_MISO: IC1#2.M14(P700) ; port SPI_CANFD.MISO
CANFD_MOSI: IC1#2.L12(P701) ; port SPI_CANFD.MOSI
CANFD_SCK: IC1#2.L13(P702) ; port SPI_CANFD.SCK
CANFD_SS: IC1#2.L11(P703) ; port SPI_CANFD.SS_0
CMOS_DRIVE0_0: IC1#2.C10(P900) ; port DRIVE_0.CMOS_0
CMOS_DRIVE0_1: IC1#2.B9(P901) ; port DRIVE_0.CMOS_1
CMOS_DRIVE0_INV: IC1#2.C9(P903) ; port DRIVE_0.INV
CMOS_DRIVE0_SF: IC1#2.D9(P904) ; port DRIVE_0.STATUS_OPEN_DRAIN
CMOS_DRIVE0_SLEW: IC1#2.D10(P902) ; port DRIVE_0.SLEW
CMOS_DRIVE1_0: IC1#2.L7(P507) ; port DRIVE_1.CMOS_0
CMOS_DRIVE1_1: IC1#2.L6(PA04) ; port DRIVE_1.CMOS_1
CMOS_DRIVE1_INV: IC1#2.M5(P606) ; port DRIVE_1.INV
CMOS_DRIVE1_SF: port DRIVE_1.STATUS_OPEN_DRAIN
CMOS_DRIVE1_SLEW: IC1#2.M7(P508) ; port DRIVE_1.SLEW
DAC0: IC1#2.P7(P014) ; port EXTRA.DAC
GPIO_0: IC1#2.P14(P514) ; harness EXTRA_GPIO.GPIO_A
GPIO_1: IC1#2.R14(P515) ; harness EXTRA_GPIO.GPIO_B
GPIO_2: IC1#2.N12(P807) ; harness EXTRA_GPIO.GPIO_C
I3C_SCL: IC1#2.R15(P400) R48.1 ; port I3C.SCL
I3C_SDA: IC1#2.P15(P401) R49.2 ; port I3C.SDA
IN_IRQ: IC1#2.K9(P511) ; port EXTRA.IN_IRQ
IRQ0: IC1#2.A6(P905)  [project net IRQ0_4]
IRQ1: IC1#2.E15(P709)  [project net IRQ1_4]
IRQ2: IC1#2.C8(P908)  [project net IRQ2_4]
IRQ_NMI: IC1#2.B8(P200) ; port EXTRA.NMI_IRQ
JTAG_EXT_RST: IC1#2.A9(RES) ; port JTAG.JTAG_RST
JTAG_EXT_TCK: IC1#2.E10(P211/TCK/_SWCLK) ; port JTAG.JTAG_TCK
JTAG_EXT_TDI: IC1#2.F8(P208/TDI) ; port JTAG.JTAG_TDI
JTAG_EXT_TMS: IC1#2.D8(P210/_TMS/_SWDIO) ; port JTAG.JTAG_TMS
JTAG_TDO: IC1#2.F9(P209/TDO) ; port JTAG.JTAG_TDO
LED0: IC1#2.H10(PB04) J8.P0  [project net LED0_4]
LED1: IC1#2.H11(PB05) J9.P0  [project net LED1_4]
LED2: IC1#2.J10(PB02) J10.P0  [project net LED2_4]
LED3: IC1#2.J11(PB06) J11#2.P1  [project net LED3_4]
LED4: IC1#2.J12(PB07) J12.P0  [project net LED4_4]
LED5: IC1#2.G11(P713) J13.P0  [project net LED5_4]
LED6: IC1#2.E12(P712) J14.P0  [project net LED6_4]
LED7: IC1#2.E13(P708) J15.P0  [project net LED7_4]
P000_INT: J16.P1 ; port ETH_1.INT  [project net 1-INT]
SD_CD: IC1#2.K7(P503) ; port SDHI_0.SD-CD
SD_CLK: IC1#2.P4(P810) ; port SDHI_0.SD-CLK
SD_CMD: IC1#2.M6(P811) ; port SDHI_0.SD-CMD
SD_DATA0: IC1#2.R4(P812) ; port SDHI_0.SD-DAT0
SD_DATA1: IC1#2.P5(P500) ; port SDHI_0.SD-DAT1
SD_DATA2: IC1#2.R5(P501) ; port SDHI_0.SD-DAT2
SD_DATA3: IC1#2.P6(P502) ; port SDHI_0.SD-DAT3
WatchdogPulse: IC1#2.M15(PB03) ; port Pulse
NetD1_A: D1.A J8.P1
NetD1_K: D1.K R11.1
NetD2_A: D2.A J9.P1
NetD2_K: D2.K R12.1
NetD3_A: D3.A J10.P1
NetD3_K: D3.K R13.1
NetD4_A: D4.A J11#2.P0
NetD4_K: D4.K R14.1
NetD5_A: D5.A J12.P1
NetD5_K: D5.K R15.1
NetD6_A: D6.A J13.P1
NetD6_K: D6.K R16.1
NetD7_A: D7.A J14.P1
NetD7_K: D7.K R17.1
NetD8_A: D8.A J15.P1
NetD8_K: D8.K R18.1
NetD17_A: D17.A J17.P0
NetD17_K: D17.K R47.1
NetIC1#2_A14: IC1#2.A14(P814/_USB_DP) ; port USB2_A.USB_DEBUG_P
NetIC1#2_B14: IC1#2.B14(P815/_USB_DM) ; port USB2_A.USB_DEBUG_N
NetIC1#2_E9: IC1#2.E9(P201/MD) ; port MD
NetIC1#2_L4: IC1#2.L4(P602) ; port UART_RAW.RX
NetIC1#2_M4: IC1#2.M4(P603) ; port UART_RAW.TX
NetIC1#2_R13: IC1#2.R13(P000) J16.P0

Not connected (* = marked no-connect by the designer): IC1#2 A7(P909) A10(P314) A12(P204) A15(P413) B1(P609) B6(P311) B7(P907) B10(P313) B12(P205) B15(P408) C1(PA14) C5(P915) C6(P309) C7(P906) C11(P315) C15(P412) D1(P611) D2(PA12) D4(PA11) D6(P310) D7(P312) D11(P206) D12(P407) D13(P411) D14(P410) E1(PA09) E2(P613) E3(P615) E4(P610) E5(PA13) E6(P911) E8(P913) E11(P409) E14(P710) F2(PA10) F3(P612) F4(P614) F5(PA15) F6(P914) F7(P912) F10(P711) F11(P715) F14(USBHS__DP) F15(USBHS__DM) G3(PA08) G5(PA07) G10(P714) G13(USBHS__RREF) K1(P107) K2(P106) K3(P600) K4(P601) K5(P605) K6(PA02) K8(P505) K10(P705) K11(P707) K12(P704) K13(P706) L1(P104) L2(P103) L3(P105) L5(PA06) L8(P509) L10(P404) L14(PB00) L15(PB01) M1(P102) M2(P101) M3(P800) M8(P010) M12(P402) M13(P406_/EXCIN)* N1(P100) N2(P801) N3(P803) N4(P604) N5(P504) N6(P506) N7(P510) N13(P512) N14(P403) N15(P405) P1(P802) P2(P804) P10(P004) P11(P003) P12(P001) P13(P513) R1(P808) R2(P809) R11(P006) R12(P002)

### Buses and harness runs
bus LED[0..4]
bus LED[0..7]
bus LED[5..5]
bus LED[6..7]

### Layout directives
differential pair: NetIC1#2_A14, NetIC1#2_B14
rule Length Constraint [Min Length = 9.9mm    Max Length = 10.1mm]: Board_EXTAL_4, Board_XCIN_4, Board_XCOUT_4, Board_XTAL_4

### Notes on the sheet
- Debug Leds
- Main MCU
- SubClock Crystal
- Main Crystal
- Labels drawn without touching a wire or pin: IN_IRQ
- Title:
- Author:
- Checked By:
- Approved:
- Size:
- Date:
- Git Hash:
- A3
- Prj:
- Variant:
- SW Version:
- Description:

### Library data of the parts
C2-C5 = VJ0805D150JXPQJHT: as C30 on sheet CanFD; Part Number: VJ0805D150JXPQJHT; Applications: RF, Microwave, High Frequency; Capacitance: 15 pF; componentlink1description: Datasheet; componentlink1url: https://www.vishay.com/docs/45239/vjhifreqht.pdf; componentlink2description: DigiKey Link; componentlink2url: https://www.digikey.com/en/products/detail/vishay-vitramon/VJ0805D150JXPQJHT/14292748; Device Package: 0805 (2012 Metric); Features: High Temperature; lastupdated: 04/02/2024 20:15:19; Lifecycle Status: Active; Minimum Order: 1; Mounting Type: Surface Mount, MLCC; Operating Temperature: -55°C ~ 200°C; Package / Case: 0805 (2012 Metric); packaging: TapeAndReel; partid: 31685; Part Status: Active; price: 0.11; series: VJ HIFREQ HT; Size / Dimension: 0.079" L x 0.049" W (2.00mm x 1.25mm); Supplier 1: DigiKey; Supplier Part Number 1: 720-VJ0805D150JXPQJHTCT-ND; Thickness (Max): 0.057" (1.45mm); Voltage - Rated: 250V
D1-D8 D17 = LED_0603_RED: Yellow Plox
IC1#2 = R7FA8M1AHECBD#UC0: Integrated Circuit; Manufacturer_Name: Renesas Electronics; Datasheet Link: https://www.renesas.com/us/en/document/dst/ra8m1-group-datasheet?r=25447396; Height: 1.47mm; Manufacturer_Part_Number: R7FA8M1AHECBD#UC0; Mouser Part Number: 968-R7FA8M1AHECBDUC0; Mouser Price/Stock: https://www.mouser.co.uk/ProductDetail/Renesas-Electronics/R7FA8M1AHECBDUC0?qs=HoCaDK9Nz5en4LBg9VyLXw%3D%3D
J8-J10 J11#2 J12-J17 = Solder Bridge 805
R11-R18 R47 = 4-2176091-1: RES SMD 150 OHM 0.1% 1/4W 0805; Manufacturer: TE Connectivity Passive Product; Power (Watts): 0.25W, 1/4W; Resistance: 150 Ohms; Temperature Coefficient: ±25ppm/°C; Part Number: 4-2176091-1; ComponentLink1Description: Datasheet; ComponentLink1URL: https://www.te.com/commerce/DocumentDelivery/DDEController?Action=srchrtrv&DocNm=1773272&DocType=DS&DocLang=English; ComponentLink2Description: DigiKey Link; ComponentLink2URL: https://www.digikey.com/en/products/detail/te-connectivity-passive-product/4-2176091-1/4033932; Composition: Thin Film; Device Package: 0805 (2012 Metric); Height - Seated (Max): 0.026" (0.65mm); LastUpdated: 04/02/2024 21:05:09; Lifecycle Status: Active; Minimum Order: 1; Number of Terminations: 2; Operating Temperature: -55°C ~ 155°C; Package / Case: 0805 (2012 Metric); Packaging: TapeAndReel; PartId: 28504; Part Status: Active; Price: 0.14; Series: RP73P, Holsworthy; Size / Dimension: 0.079" L x 0.049" W (2.00mm x 1.25mm); Supplier 1: DigiKey; Supplier Part Number 1: A110464CT-ND; Supplier Device Package: 0805; Tolerance: ±0.1%
R48 R49 = RR0510P-222-D: RES SMD 2.2K OHM 0.5% 1/16W 0402; Manufacturer: Susumu; Power (Watts): 0.063W, 1/16W; Temperature Coefficient: ±25ppm/°C; Part Number: RR0510P-222-D; Value: 2.2 kOhms; ComponentLink1Description: Datasheet; ComponentLink1URL: http://www.susumu.co.jp/common/pdf/n_catalog_partition05_en.pdf; ComponentLink2Description: DigiKey Link; ComponentLink2URL: https://www.digikey.com/en/products/detail/susumu/RR0510P-222-D/432405; Composition: Thin Film; Device Package: 0402 (1005 Metric); Height - Seated (Max): 0.016" (0.40mm); LastUpdated: 09/02/2024 20:30:21; Lifecycle Status: Active; Minimum Order: 1; Number of Terminations: 2; Operating Temperature: -55°C ~ 125°C; Package / Case: 0402 (1005 Metric); Packaging: TapeAndReel; PartId: 3229; Part Status: Active; Price: 0.01; Resistance: 2.2 kOhms; Series: RR; Size / Dimension: 0.039" L x 0.020" W (1.00mm x 0.50mm); Supplier 1: DigiKey; Supplier Part Number 1: RR05P2.2KDCT-ND; Tolerance: ±0.5%
Y1 = 830062558: WE-XTAL Watch Crystal, SMT, IQXC-25, 32.768kHz, +/-10ppm; Manufacturer: Wurth Elektronik; Load Capacitance: 9pF; ComponentLink1Description: Website Link; ComponentLink1URL: https://www.we-online.com/redexpert/article/830062558?ad; ComponentLink2Description: Datasheet Link; ComponentLink2URL: https://www.we-online.com/redexpert/spec/830062558?ad; Manufacturer Part Number: 830062558; Category: Crystals; Match Code: WE-XTAL; Mount: Surface Mount; Operating Temperature Max: 85°C; Operating Temperature Min: -40°C; Packaging: Tape and Reel; Case/Size Code: IQXC-25; Length: 2mm; Width: 1.2mm; Height: 0.6mm; Frequency: 32.768kHz; Frequency Tolerance: +/-10ppm
Y2 = 830108207209: WE-XTAL Quartz Crystal, SMT, CFPX-180, 20MHz, +/-10ppm; Manufacturer: Wurth Elektronik; Frequency Stability: +/-20ppm; Load Capacitance: 8pF; ComponentLink1Description: Website Link; ComponentLink1URL: https://www.we-online.com/redexpert/article/830108207209?ad; ComponentLink2Description: Datasheet Link; ComponentLink2URL: https://www.we-online.com/redexpert/spec/830108207209?ad; Manufacturer Part Number: 830108207209; Category: Crystals; Match Code: WE-XTAL; Mount: Surface Mount; Operating Temperature Max: 85°C; Operating Temperature Min: -40°C; Packaging: Tape and Reel; Case/Size Code: CFPX-180; Length: 3.4mm; Width: 2.7mm; Height: 0.8mm; Frequency: 20MHz; Frequency Tolerance: +/-10ppm

## Sheet JTAG.SchDoc: OnBoard Debugger
size A4; ApprovedBy: Diogo Gomes; CheckedBy: Bruno, Candido, Pedro; Author: João Vieira; CompanyName: LART; DrawnBy: João Vieira; Organization: LART; Address1: Morro do Lena; Address2: Alto Do Vieiro; Address3: APT 4163, Building D; DocumentNumber: 1; Revision: v1.4.2; SheetNumber: 2; SheetTotal: 12; ENG_APP_DATE: --/--/--; DSN_APP_DATE: --/--/--; CHK_APP_DATE: --/--/--; ProjectTitle: Autonomous Control Unit; Summary: The Debugger Interface as a alternative to using an offboard programmer; CheckedBy1: G. Candido; CheckedBy2: F. Chen; CheckedBy3: P. Ferreira; CheckedBy4: B. Vicente; CheckedBy5: _; CheckedBy6: _; CheckedBy7: _; version_tag: 1.4.2; ImagePath: C:\Users\micron\Desktop
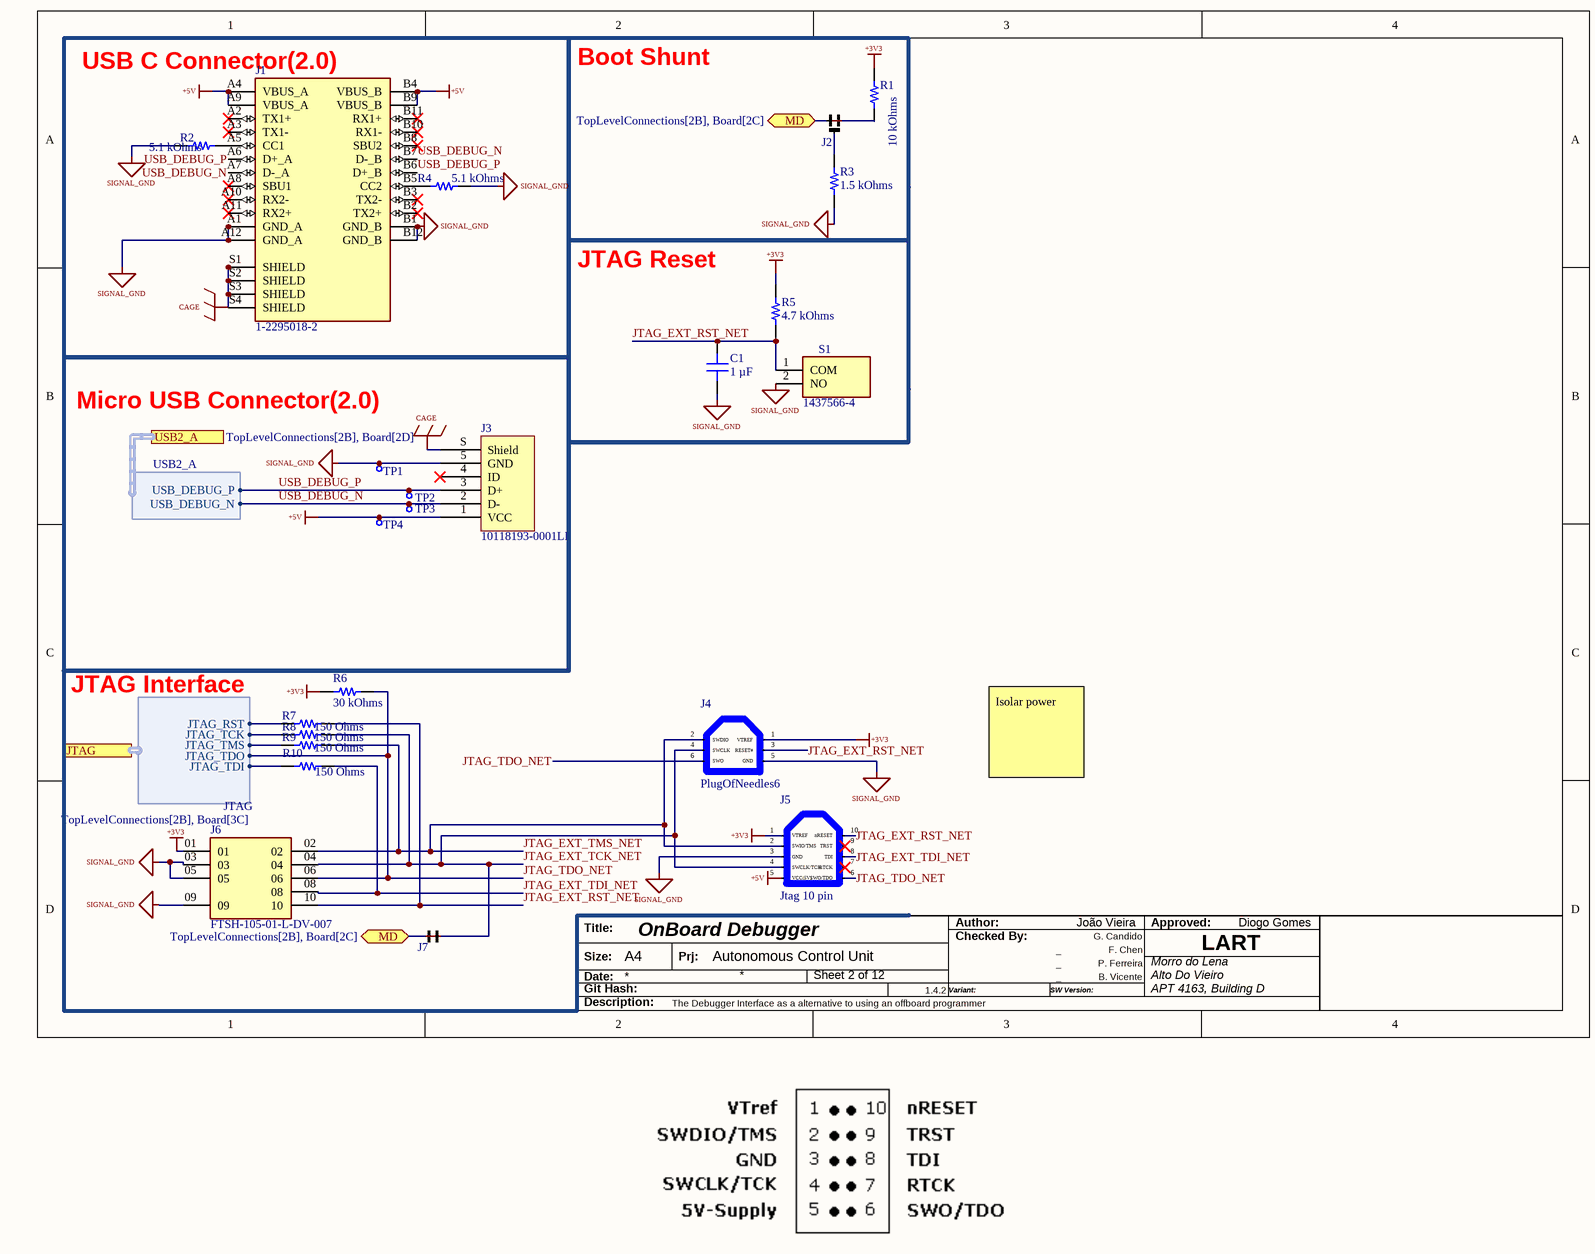
[diagram p4: JTAG.SchDoc]

### Parts
(Parts that share a designator on the sheet are numbered #1, #2 ... from top to bottom, then left to right.)
C1  value 1 µF  [CAP 0805_2012]  (hidden comment: 1uF)
J1  1-2295018-2  [TE_1-2295018-2]
J2  A solder Bridge  [Solder Bridge 805 switch]  (value not drawn)
J3  10118193-0001LF  [FCI USB 10118193-0001LF]
J4#2  PlugOfNeedles6  [Pluck-Of-Needles 6 POS naked]
J5  Jtag 10 pin  [Pluck-Of-Needles 10 POS]
J6  FTSH-105-01-L-DV-007  [SAMTEC_FTSH-105-01-L-DV-007]
J7  A solder Bridge  [Solder Bridge 805]  (value not drawn)
R1  value 10 kOhms  [RES 0805_2012]  (hidden comment: 10k)
R2  5.1 kOhms  [RES 0805_2012]
R3  value 1.5 kOhms  [RES 0805_2012]  (hidden comment: 1.5k)
R4  5.1 kOhms  [RES 0805_2012]
R5  value 4.7 kOhms  [RES 0805_2012]  (hidden comment: 4.7k)
R6  value 30 kOhms  [RES 0805_2012]  (hidden comment: 30k)
R7  value 150 Ohms  [RES 0805_2012]  (hidden comment: 150)
R8  value 150 Ohms  [RES 0805_2012]  (hidden comment: 150)
R9  value 150 Ohms  [RES 0805_2012]  (hidden comment: 150)
R10  value 150 Ohms  [RES 0805_2012]  (hidden comment: 150)
S1  1437566-4  [14375664]
TP1  TestPad  [Test Pad Small]  (value not drawn)
TP2  TestPad  [Test Pad Miniscule]  (value not drawn)
TP3  TestPad  [Test Pad Miniscule]  (value not drawn)
TP4  TestPad  [Test Pad Small]  (value not drawn)

### Blocks framed on the sheet
Boot Shunt: J2 R1 R3
JTAG Reset: C1 R5 S1

### Ports
JTAG (harness JTAG, see TopLevelConnections[2B], Board[3C]), MD (bidir, see TopLevelConnections[2B], Board[2C]), USB2_A (harness USB2_A, see TopLevelConnections[2B], Board[2D])

### Harnesses
JTAG: JTAG_RST, JTAG_TCK, JTAG_TMS, JTAG_TDO, JTAG_TDI
USB2_A: USB_DEBUG_N, USB_DEBUG_P

### Nets
+3V3: J4#2.1(VTREF) J5.1(VTREF) J6.01 R1.2 R5.2 R6.2
+5V: J1.A4(VBUS_A) J1.A9(VBUS_A) J1.B4(VBUS_B) J1.B9(VBUS_B) J3.1(VCC) J5.5(VCC(5V)) TP4.P2
CAGE: J1.S1(SHIELD) J1.S2(SHIELD) J1.S3(SHIELD) J1.S4(SHIELD) J3.S(Shield)
SIGNAL_GND: C1.1 J1.A1(GND_A) J1.A12(GND_A) J1.B1(GND_B) J1.B12(GND_B) J3.5(GND) J4#2.5(GND) J5.3(GND) J6.03 J6.05 J6.09 R2.1 R3.1 R4.2 S1.2(NO) TP1.P2
JTAG_EXT_RST: R7.1 ; port JTAG.JTAG_RST
JTAG_EXT_RST_NET: C1.2 J4#2.3(RESET#) J5.10(nRESET) J6.10 R5.1 R7.2 S1.1(COM)  [project net JTAG_EXT_RST_NET_2]
JTAG_EXT_TCK: R8.1 ; port JTAG.JTAG_TCK
JTAG_EXT_TCK_NET: J4#2.4(SWCLK) J5.4(SWCLK/TCK) J6.04 J7.P1 R8.2  [project net JTAG_EXT_TCK_NET_2]
JTAG_EXT_TDI: R10.1 ; port JTAG.JTAG_TDI
JTAG_EXT_TDI_NET: J5.8(TDI) J6.08 R10.2  [project net JTAG_EXT_TDI_NET_2]
JTAG_EXT_TMS: R9.1 ; port JTAG.JTAG_TMS
JTAG_EXT_TMS_NET: J4#2.2(SWDIO) J5.2(SWIO/TMS) J6.02 R9.2  [project net JTAG_EXT_TMS_NET_2]
JTAG_TDO_NET: J4#2.6(SWO) J5.6(SWO/TDO) J6.06 R6.1 ; port JTAG.JTAG_TDO  [project net JTAG_TDO]
USB_DEBUG_N: J1.A7(D-_A) J1.B7(D-_B) J3.2(D-) TP3.P2 ; port USB2_A.USB_DEBUG_N
USB_DEBUG_P: J1.A6(D+_A) J1.B6(D+_B) J3.3(D+) TP2.P2 ; port USB2_A.USB_DEBUG_P
NetIC1#2_E9: J2.P1 J7.P0 ; port MD
NetJ1_A5: J1.A5(CC1) R2.2
NetJ1_B5: J1.B5(CC2) R4.1
NetJ2_P0: J2.P0 R1.1
NetJ2_P2: J2.P2 R3.2

Not connected (* = marked no-connect by the designer): J1 A2(TX1+)* A3(TX1-)* A8(SBU1)* A10(RX2-)* A11(RX2+)* B2(TX2+)* B3(TX2-)* B8(SBU2)* B10(RX1-)* B11(RX1+)*; J3 4(ID)*; J5 7(RTCK)* 9(TRST)*

### Notes on the sheet
- (near J1) USB C Connector(2.0)
- Micro USB Connector(2.0)
- JTAG Interface
- Isolar power
- Title:
- Author:
- Checked By:
- Approved:
- Size:
- Date:
- Git Hash:
- A4
- Prj:
- Variant:
- SW Version:
- Description:

### Library data of the parts
C1 = 0805B105K160CT: CAP CER 1UF 16V X7R 0805; manufacturer: Walsin Technology Corporation; Tolerance: ±10%; Part Number: 0805B105K160CT; Applications: General Purpose; Capacitance: 1 µF; componentlink1description: Datasheet; componentlink1url: https://www.passivecomponent.com/wp-content/uploads/datasheet/WTC_MLCC_General_Purpose.pdf; componentlink2description: DigiKey Link; componentlink2url: https://www.digikey.com/en/products/detail/walsin-technology-corporation/0805B105K160CT/6707557; Device Package: 0805 (2012 Metric); lastupdated: 09/02/2024 20:15:01; Lifecycle Status: Active; Minimum Order: 1; Mounting Type: Surface Mount, MLCC; Operating Temperature: -55°C ~ 125°C; Package / Case: 0805 (2012 Metric); packaging: TapeAndReel; partid: 39843; Part Status: Active; price: 0.01; series: -; Size / Dimension: 0.079" L x 0.049" W (2.00mm x 1.25mm); Supplier 1: DigiKey; Supplier Part Number 1: 1292-0805B105K160CT-ND; Temperature Coefficient: X7R; Thickness (Max): 0.053" (1.35mm); Voltage - Rated: 16V
J1 = 1-2295018-2: USB-C (USB TYPE-C) USB 3.2 Gen 2 (USB 3.1 Gen 2, Superspeed + (USB 3.1)) Receptacle Connector 24 Position Board Cutout, Surface Mount, Right Angle; Through Hole; MF: TE Connectivity AMP Connectors; Price: None; MP: 1-2295018-2; Package: None; Value: *; Purchase-URL: https://pricing.snapeda.com/search/part/1-2295018-2/?ref=eda; Availability: In Stock; SnapEDA_Link: https://www.snapeda.com/parts/1-2295018-2/TE+Connectivity/view-part/?ref=snap; Check_prices: https://www.snapeda.com/parts/1-2295018-2/TE+Connectivity/view-part/?ref=eda
J2 = Solder Bridge 805 Switch
J3 = 10118193-0001LF: CONN RCPT USB2.0 MICRO B SMD R/A; Manufacturer: Amphenol ICC (FCI); Connector Type: USB - micro B; Current Rating (Amps): 1.8A per Contact; Gender: Receptacle; Mating Cycles: 10000; Number of Contacts: 5; Number of Ports: 1; Shielding: Shielded; Voltage - Rated: 100VAC; Part Number: 10118193-0001LF; ComponentLink1Description: Datasheet; ComponentLink1URL: https://cdn.amphenol-icc.com/media/wysiwyg/files/documentation/datasheet/inputoutput/io_usb_micro.pdf; ComponentLink2Description: DigiKey Link; ComponentLink2URL: //digikey.com/product-detail/en/amphenol-icc-fci/10118193-0001LF/609-4616-2-ND/2785388; Features: Solder Retention; LastUpdated: 09/12/2019 20:51:28; Lifecycle Status: 0; Minimum Order: 1; Mounting Feature: Horizontal; Mounting Type: Surface Mount, Right Angle; Through Hole; Operating Temperature: -30°C ~ 80°C; Packaging: TapeAndReel; Part Status: Active; Price: 0.21; Series: -; Specifications: USB 2.0; Supplier 1: DigiKey; Supplier Part Number 1: 609-4616-2-ND; Termination: Solder
J5 = PlugOfNeedles10: A short footprint for jtag
J6 = FTSH-105-01-L-DV-007: Connector Header Surface Mount 10 position 0.050 (1.27mm); MP: FTSH-105-01-L-DV-007-K; MF: Samtec; Package: None; Purchase-URL: https://pricing.snapeda.com/search/part/FTSH-105-01-L-DV-007-K/?ref=eda; Digi-Key_Part_Number: SAM13932TR-ND; Check_prices: https://www.snapeda.com/parts/FTSH-105-01-L-DV-007-K/Samtec%20Inc./view-part/448626/?ref=eda; Value: *; SnapEDA_Link: https://www.snapeda.com/parts/FTSH-105-01-L-DV-007-K/Samtec%20Inc./view-part/448626/?ref=snap
J7 = Solder Bridge 805
R1 = RNCS0805BKE10K0: RES 10K OHM 0.1% 1/10W 0805; Manufacturer: Stackpole Electronics Inc; Power (Watts): 0.1W, 1/10W; Temperature Coefficient: ±25ppm/°C; Part Number: RNCS0805BKE10K0; ComponentLink1Description: Datasheet; ComponentLink1URL: https://www.seielect.com/catalog/sei-rncs_rnch.pdf; ComponentLink2Description: DigiKey Link; ComponentLink2URL: https://www.digikey.com/en/products/detail/stackpole-electronics-inc/RNCS0805BKE10K0/1800067; Composition: Thin Film; Device Package: 0805 (2012 Metric); Features: Anti-Corrosive, Automotive AEC-Q200, Moisture Resistant; Height - Seated (Max): 0.026" (0.65mm); LastUpdated: 08/02/2024 21:02:39; Lifecycle Status: Active; Minimum Order: 1; Number of Terminations: 2; Operating Temperature: -55°C ~ 155°C; Package / Case: 0805 (2012 Metric); Packaging: TapeAndReel; PartId: 27713; Part Status: Active; Price: 0.07; Ratings: AEC-Q200; Resistance: 10 kOhms; Series: RNCS; Size / Dimension: 0.079" L x 0.049" W (2.00mm x 1.25mm); Supplier 1: DigiKey; Supplier Part Number 1: RNCS0805BKE10K0CT-ND; Supplier Device Package: 0805; Tolerance: ±0.1%
R2 R4 = ERA-6AED512V: RES SMD 5.1K OHM 0.5% 1/8W 0805; Manufacturer: Panasonic Electronic Components; Power (Watts): 0.125W, 1/8W; Temperature Coefficient: ±25ppm/°C; Part Number: ERA-6AED512V; Value: 5.1 kOhms; ComponentLink1Description: Datasheet; ComponentLink1URL: https://industrial.panasonic.com/cdbs/www-data/pdf/RDM0000/AOA0000C307.pdf; ComponentLink2Description: DigiKey Link; ComponentLink2URL: https://www.digikey.com/en/products/detail/panasonic-electronic-components/ERA-6AED512V/9373625; Composition: Thin Film; Device Package: 0805 (2012 Metric); Features: Automotive AEC-Q200; Height - Seated (Max): 0.024" (0.60mm); LastUpdated: 02/02/2024 21:00:47; Lifecycle Status: Active; Minimum Order: 1; Number of Terminations: 2; Operating Temperature: -55°C ~ 155°C; Package / Case: 0805 (2012 Metric); Packaging: TapeAndReel; PartId: 27812; Part Status: Active; Price: 0.04; Ratings: AEC-Q200; Resistance: 5.1 kOhms; Series: ERA-6A; Size / Dimension: 0.079" L x 0.049" W (2.00mm x 1.25mm); Supplier 1: DigiKey; Supplier Part Number 1: P123856CT-ND; Supplier Device Package: 0805; Tolerance: ±0.5%
R3 = RNCF0805DTE1K50: RES 1.5K OHM 0.5% 1/8W 0805; Manufacturer: Stackpole Electronics Inc; Power (Watts): 0.125W, 1/8W; Temperature Coefficient: ±25ppm/°C; Part Number: RNCF0805DTE1K50; ComponentLink1Description: Datasheet; ComponentLink1URL: https://www.seielect.com/catalog/sei-rncf.pdf; ComponentLink2Description: DigiKey Link; ComponentLink2URL: https://www.digikey.com/en/products/detail/stackpole-electronics-inc/RNCF0805DTE1K50/1708177; Composition: Thin Film; Device Package: 0805 (2012 Metric); Features: Automotive AEC-Q200; Height - Seated (Max): 0.026" (0.65mm); LastUpdated: 08/02/2024 21:02:37; Lifecycle Status: Active; Minimum Order: 1; Number of Terminations: 2; Operating Temperature: -55°C ~ 155°C; Package / Case: 0805 (2012 Metric); Packaging: TapeAndReel; PartId: 28003; Part Status: Active; Price: 0.01; Ratings: AEC-Q200; Resistance: 1.5 kOhms; Series: RNCF; Size / Dimension: 0.079" L x 0.049" W (2.00mm x 1.25mm); Supplier 1: DigiKey; Supplier Part Number 1: RNCF0805DTE1K50CT-ND; Supplier Device Package: 0805; Tolerance: ±0.5%
R5 = RCS08054K70JNEA: RES SMD 4.7K OHM 5% 1/2W 0805; Manufacturer: Vishay Dale; Power (Watts): 0.5W, 1/2W; Temperature Coefficient: ±200ppm/°C; Part Number: RCS08054K70JNEA; ComponentLink1Description: Datasheet; ComponentLink1URL: http://www.vishay.com/docs/20065/rcse3.pdf; ComponentLink2Description: DigiKey Link; ComponentLink2URL: https://www.digikey.com/en/products/detail/vishay-dale/RCS08054K70JNEA/5867012; Composition: Thick Film; Device Package: 0805 (2012 Metric); Features: Automotive AEC-Q200, Pulse Withstanding; Height - Seated (Max): 0.020" (0.50mm); LastUpdated: 08/02/2024 21:02:38; Lifecycle Status: Active; Minimum Order: 1; Number of Terminations: 2; Operating Temperature: -55°C ~ 155°C; Package / Case: 0805 (2012 Metric); Packaging: TapeAndReel; PartId: 27839; Part Status: Active; Price: 0.02; Ratings: AEC-Q200; Resistance: 4.7 kOhms; Series: RCS e3; Size / Dimension: 0.079" L x 0.049" W (2.00mm x 1.25mm); Supplier 1: DigiKey; Supplier Part Number 1: 541-2866-1-ND; Supplier Device Package: 0805; Tolerance: ±5%
R6 = 3430A2F30KTDF: 3430 A2 1% 30K 100PPM 1K RL; Manufacturer: TE Connectivity Passive Product; Power (Watts): 1W; Temperature Coefficient: ±100ppm/°C; Part Number: 3430A2F30KTDF; ComponentLink2Description: DigiKey Link; ComponentLink2URL: https://www.digikey.com/en/products/detail/te-connectivity-passive-product/3430A2F30KTDF/17763964; Composition: Thick Film; Device Package: 0805 (2012 Metric); Features: Automotive AEC-Q200; Height - Seated (Max): 0.026" (0.65mm); LastUpdated: 04/02/2024 21:02:40; Lifecycle Status: Active; Minimum Order: 1; Number of Terminations: 2; Operating Temperature: -55°C ~ 155°C; Package / Case: 0805 (2012 Metric); Packaging: TapeAndReel; PartId: 76016; Part Status: Active; Price: 0.02; Ratings: AEC-Q200; Resistance: 30 kOhms; Series: 3430; Size / Dimension: 0.049" L x 0.079" W (1.25mm x 2.00mm); Supplier 1: DigiKey; Supplier Part Number 1: 1712-3430A2F30KTDFCT-ND; Supplier Device Package: 0508; Tolerance: ±1%
R7-R10 = 4-2176091-1: RES SMD 150 OHM 0.1% 1/4W 0805; Manufacturer: TE Connectivity Passive Product; Power (Watts): 0.25W, 1/4W; Temperature Coefficient: ±25ppm/°C; Part Number: 4-2176091-1; ComponentLink1Description: Datasheet; ComponentLink1URL: https://www.te.com/commerce/DocumentDelivery/DDEController?Action=srchrtrv&DocNm=1773272&DocType=DS&DocLang=English; ComponentLink2Description: DigiKey Link; ComponentLink2URL: https://www.digikey.com/en/products/detail/te-connectivity-passive-product/4-2176091-1/4033932; Composition: Thin Film; Device Package: 0805 (2012 Metric); Height - Seated (Max): 0.026" (0.65mm); LastUpdated: 04/02/2024 21:05:09; Lifecycle Status: Active; Minimum Order: 1; Number of Terminations: 2; Operating Temperature: -55°C ~ 155°C; Package / Case: 0805 (2012 Metric); Packaging: TapeAndReel; PartId: 28504; Part Status: Active; Price: 0.14; Resistance: 150 Ohms; Series: RP73P, Holsworthy; Size / Dimension: 0.079" L x 0.049" W (2.00mm x 1.25mm); Supplier 1: DigiKey; Supplier Part Number 1: A110464CT-ND; Supplier Device Package: 0805; Tolerance: ±0.1%
S1 = 1437566-4: Switch; Manufacturer_Name: TE Connectivity; Datasheet Link: https://www.te.com/commerce/DocumentDelivery/DDEController?Action=showdoc&DocId=Customer+Drawing%7F1437566-3%7FC2%7Fpdf%7FEnglish%7FENG_CD_1437566-3_C7F14375662_1437566_3_1_c.dwg.pdf%-4; Height: 4.87mm; Manufacturer_Part_Number: 1437566-4; Mouser Part Number: N/A; Mouser Price/Stock: https://www.mouser.co.uk/ProductDetail/TE-Connectivity-Alcoswitch/1437566-4?qs=xoXDFGdkQ2nbcMrTmW1sHA%3D%3D; Arrow Part Number: 1437566-4; Arrow Price/Stock: https://www.arrow.com/en/products/1437566-4/te-connectivity?region=europe